# Altium schematic sheet Power_Invertor.SchDoc
size 1200 x 800 mm; SheetNumber: 1; SheetTotal: 1
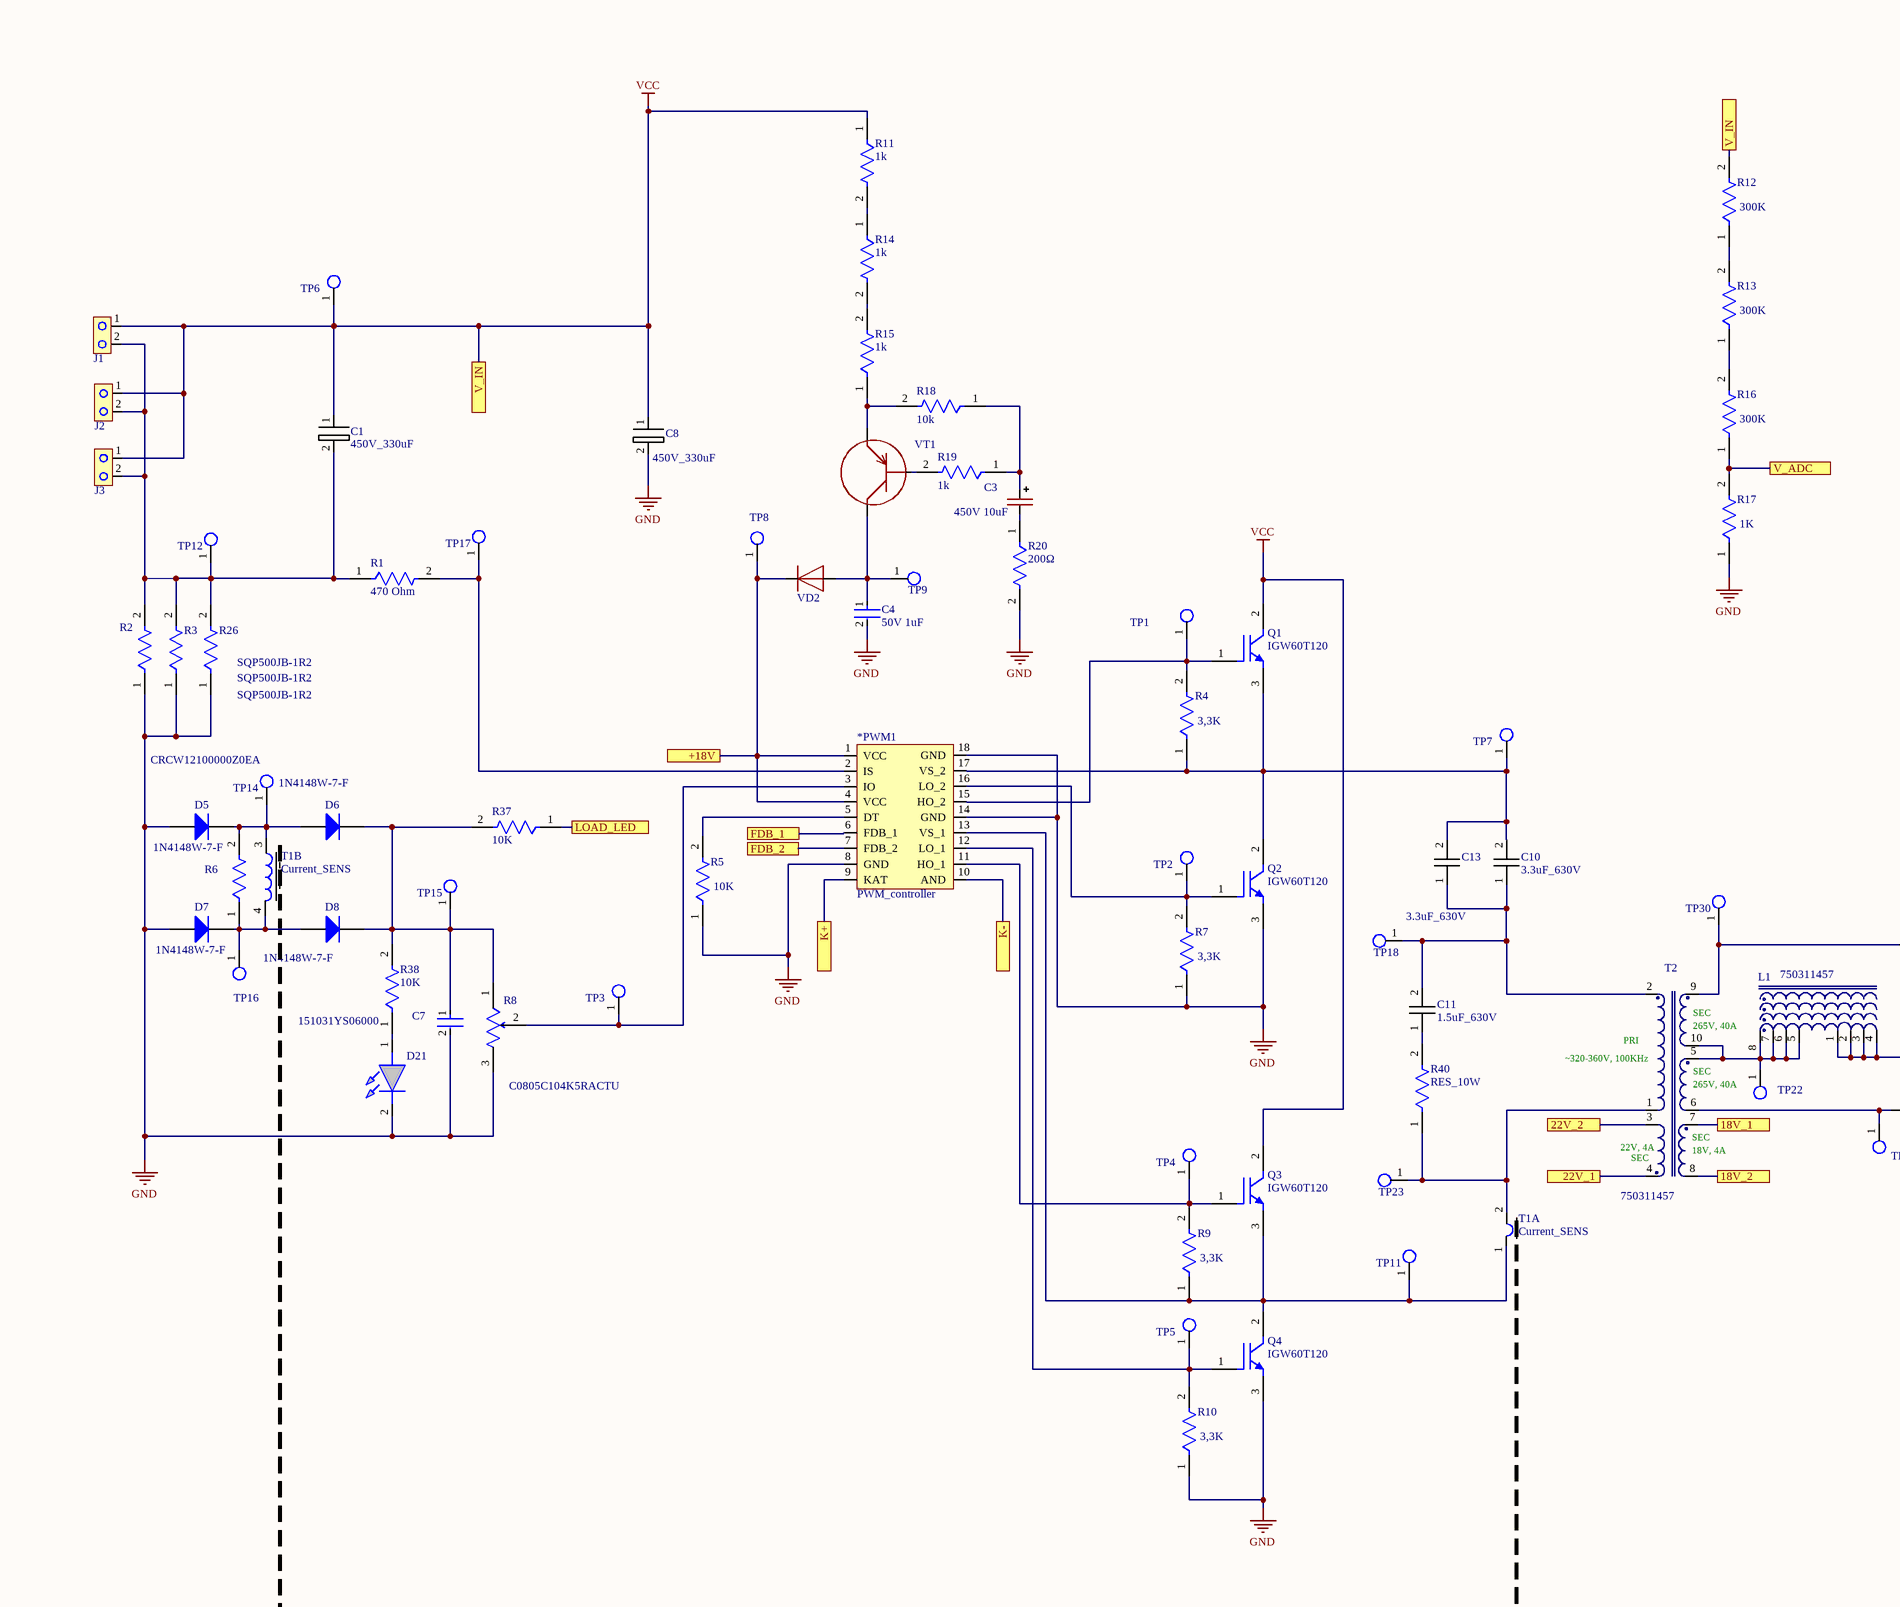
[diagram p0: Power_Invertor.SchDoc, top left]
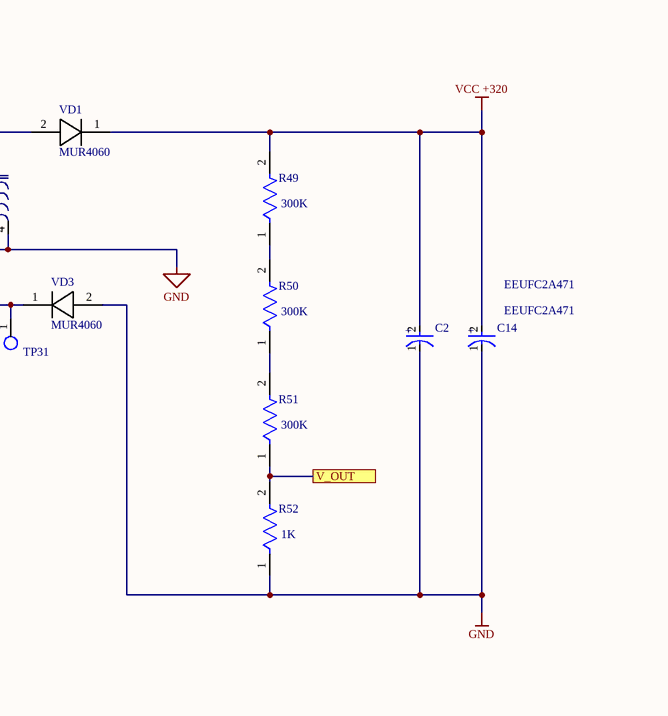
[diagram p1: Power_Invertor.SchDoc, top middle]
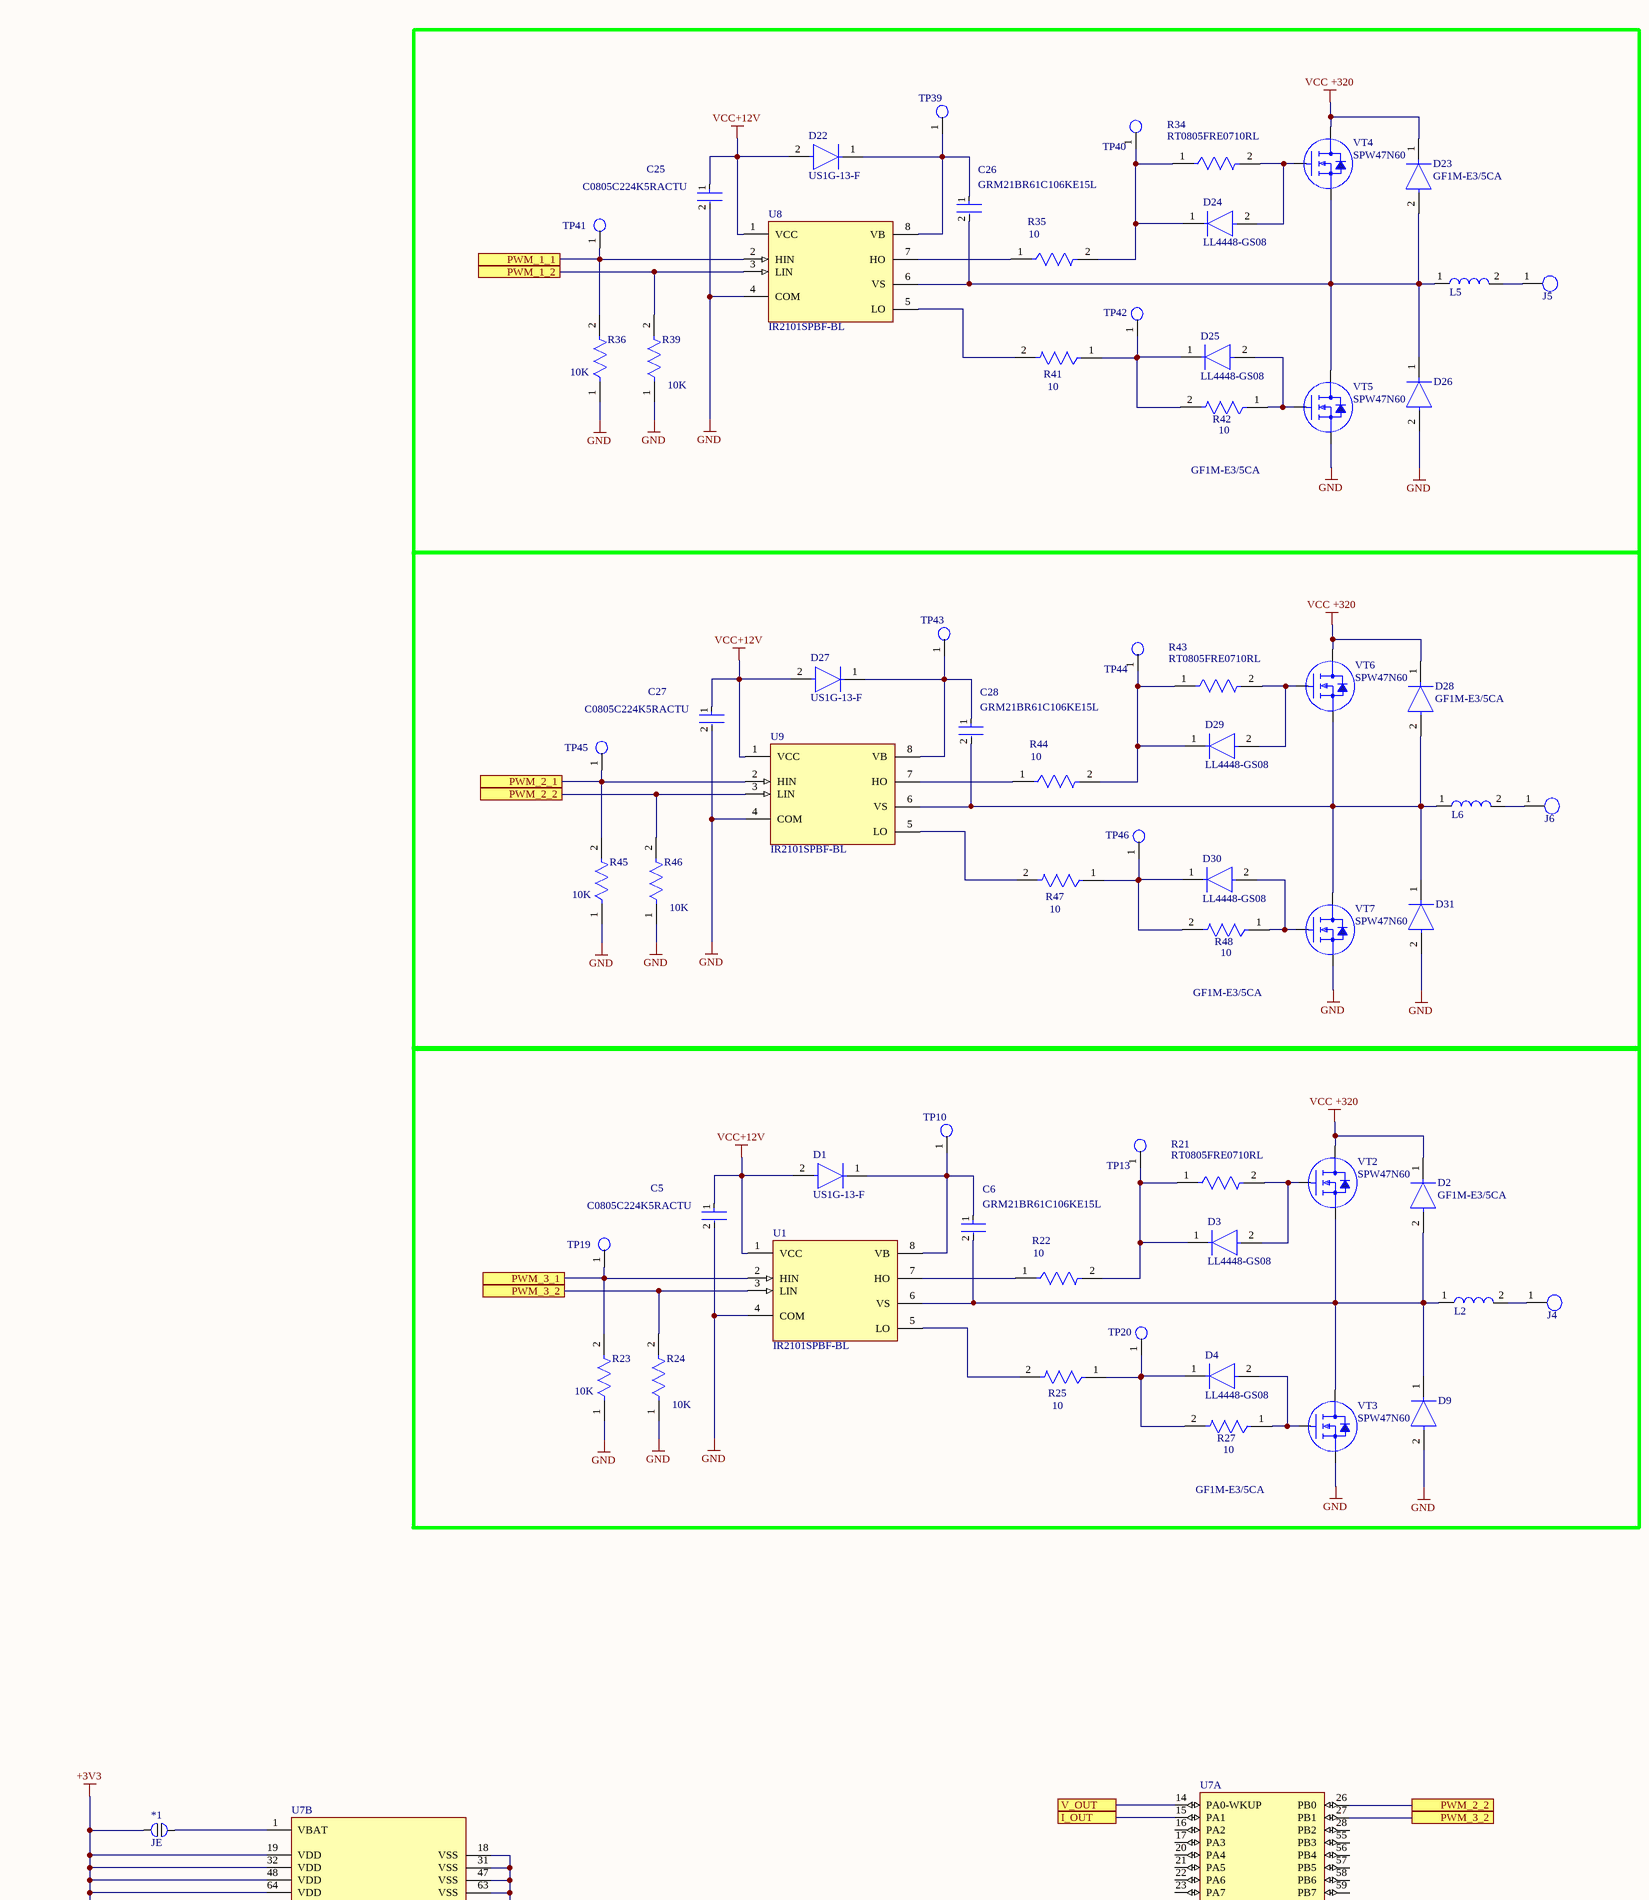
[diagram p2: Power_Invertor.SchDoc, top right]
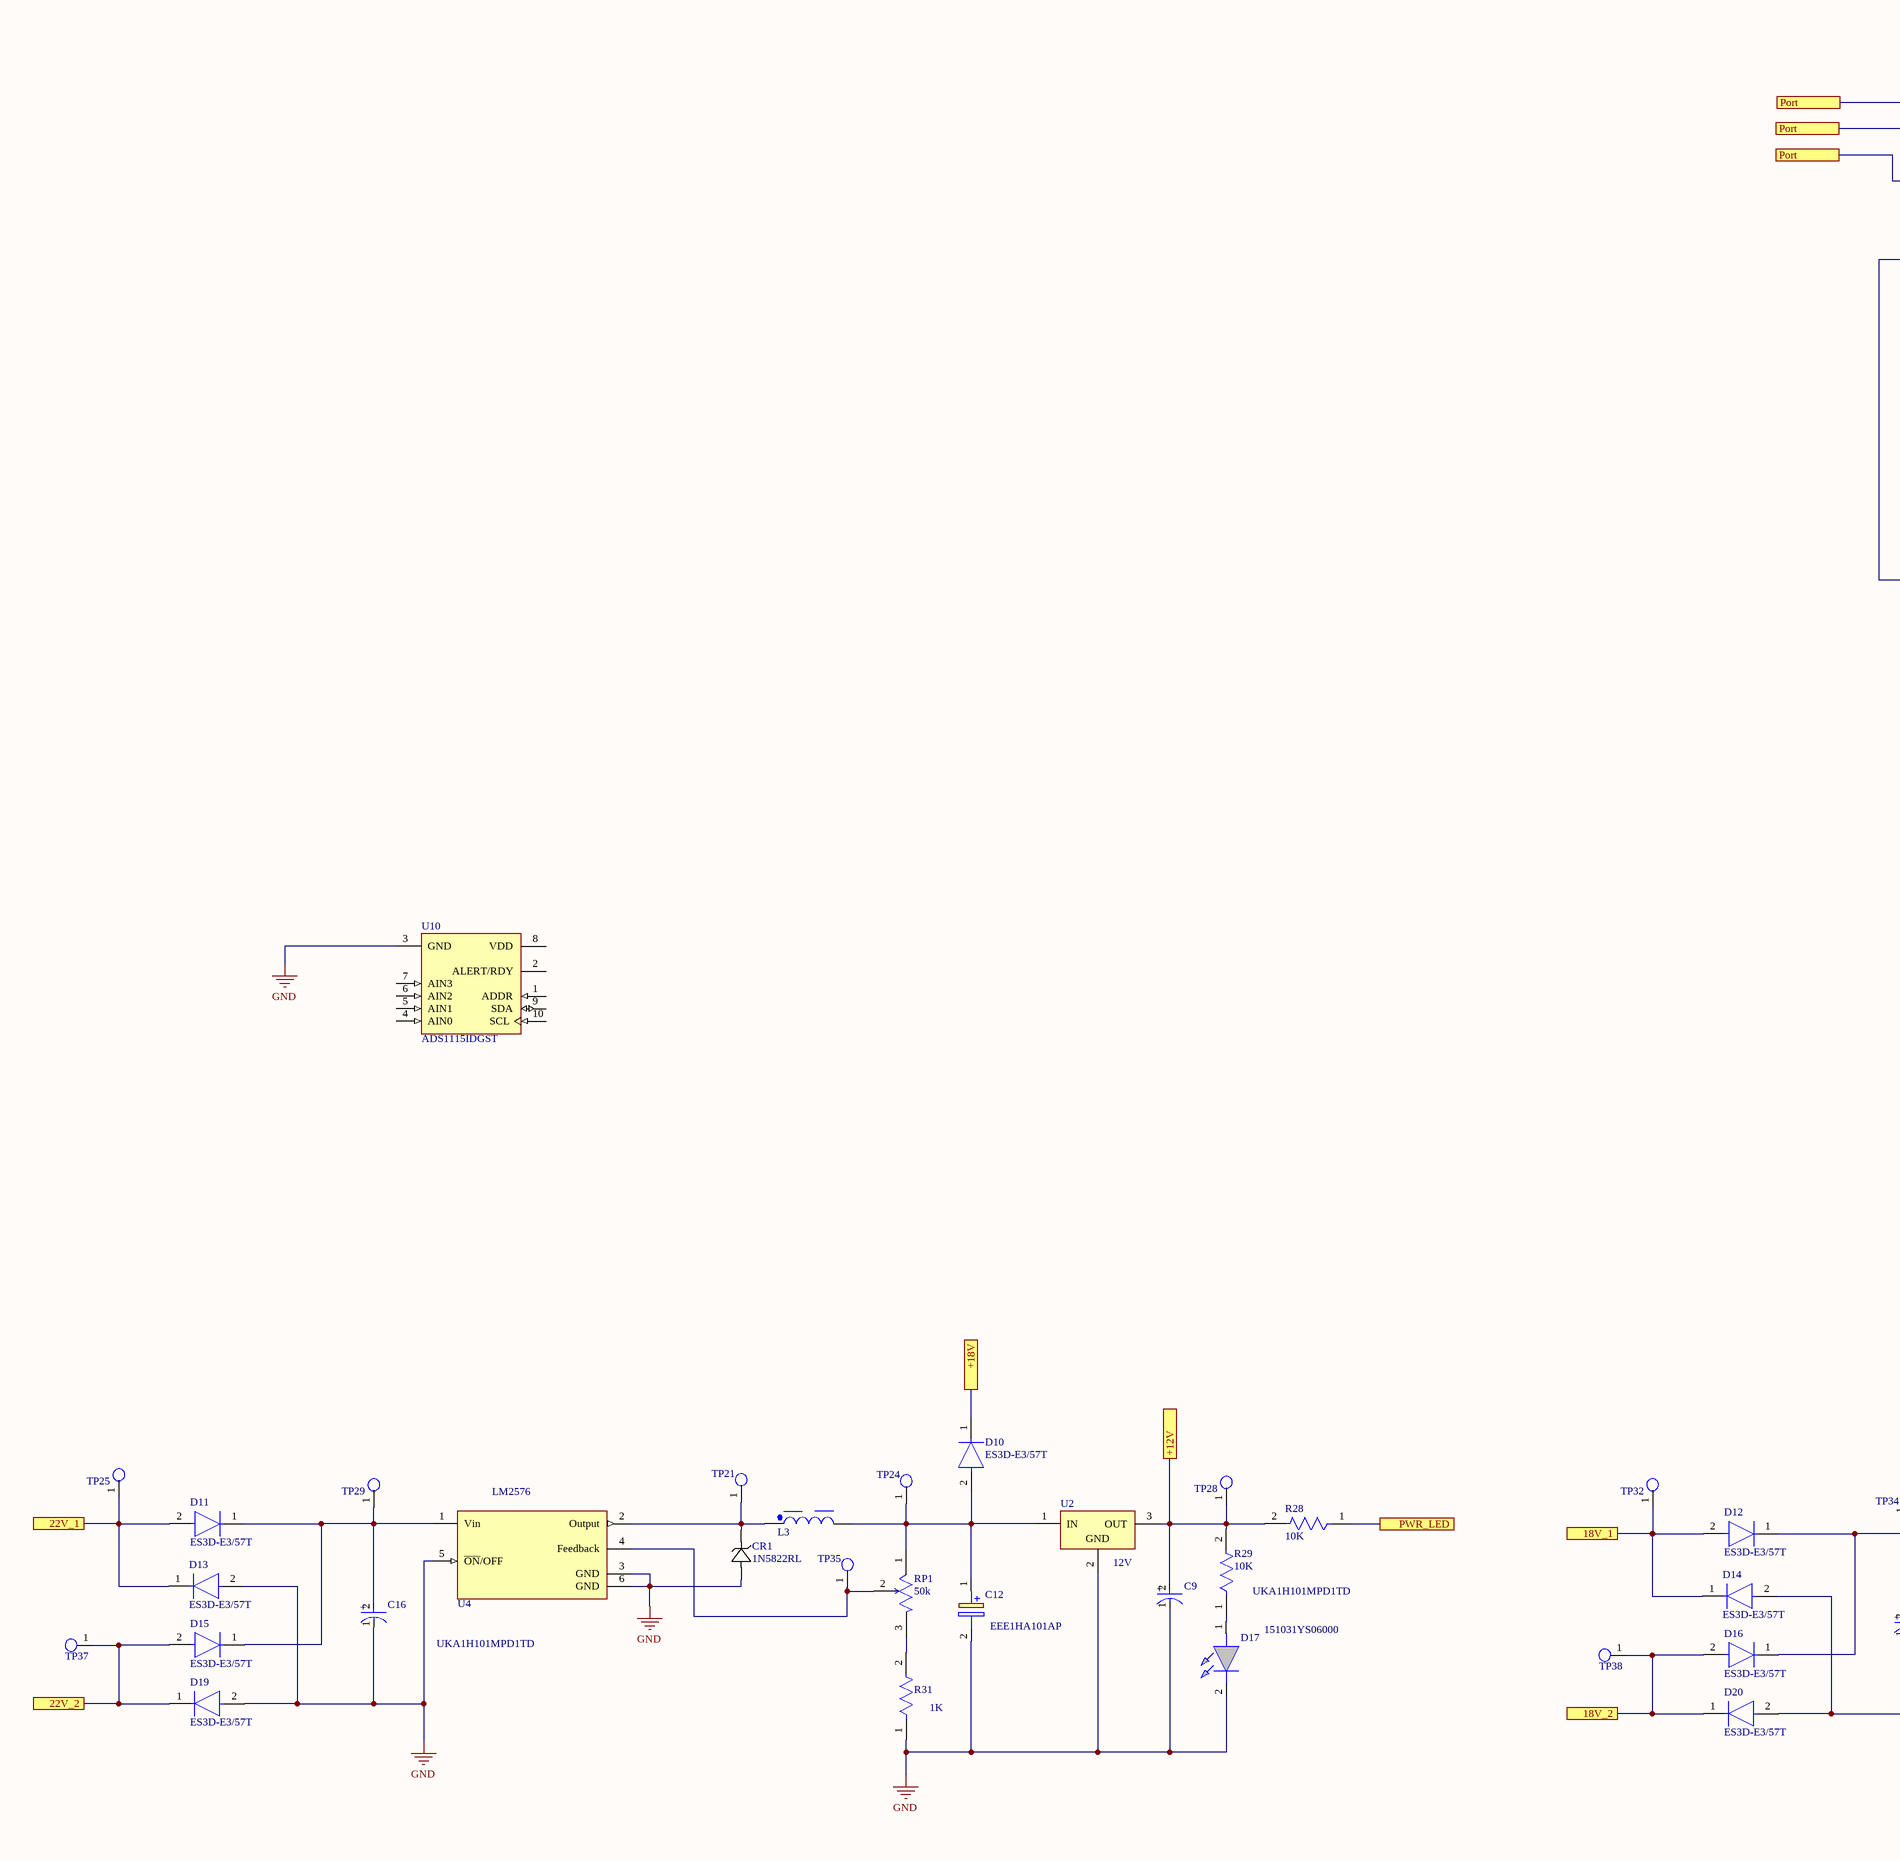
[diagram p3: Power_Invertor.SchDoc, bottom left]
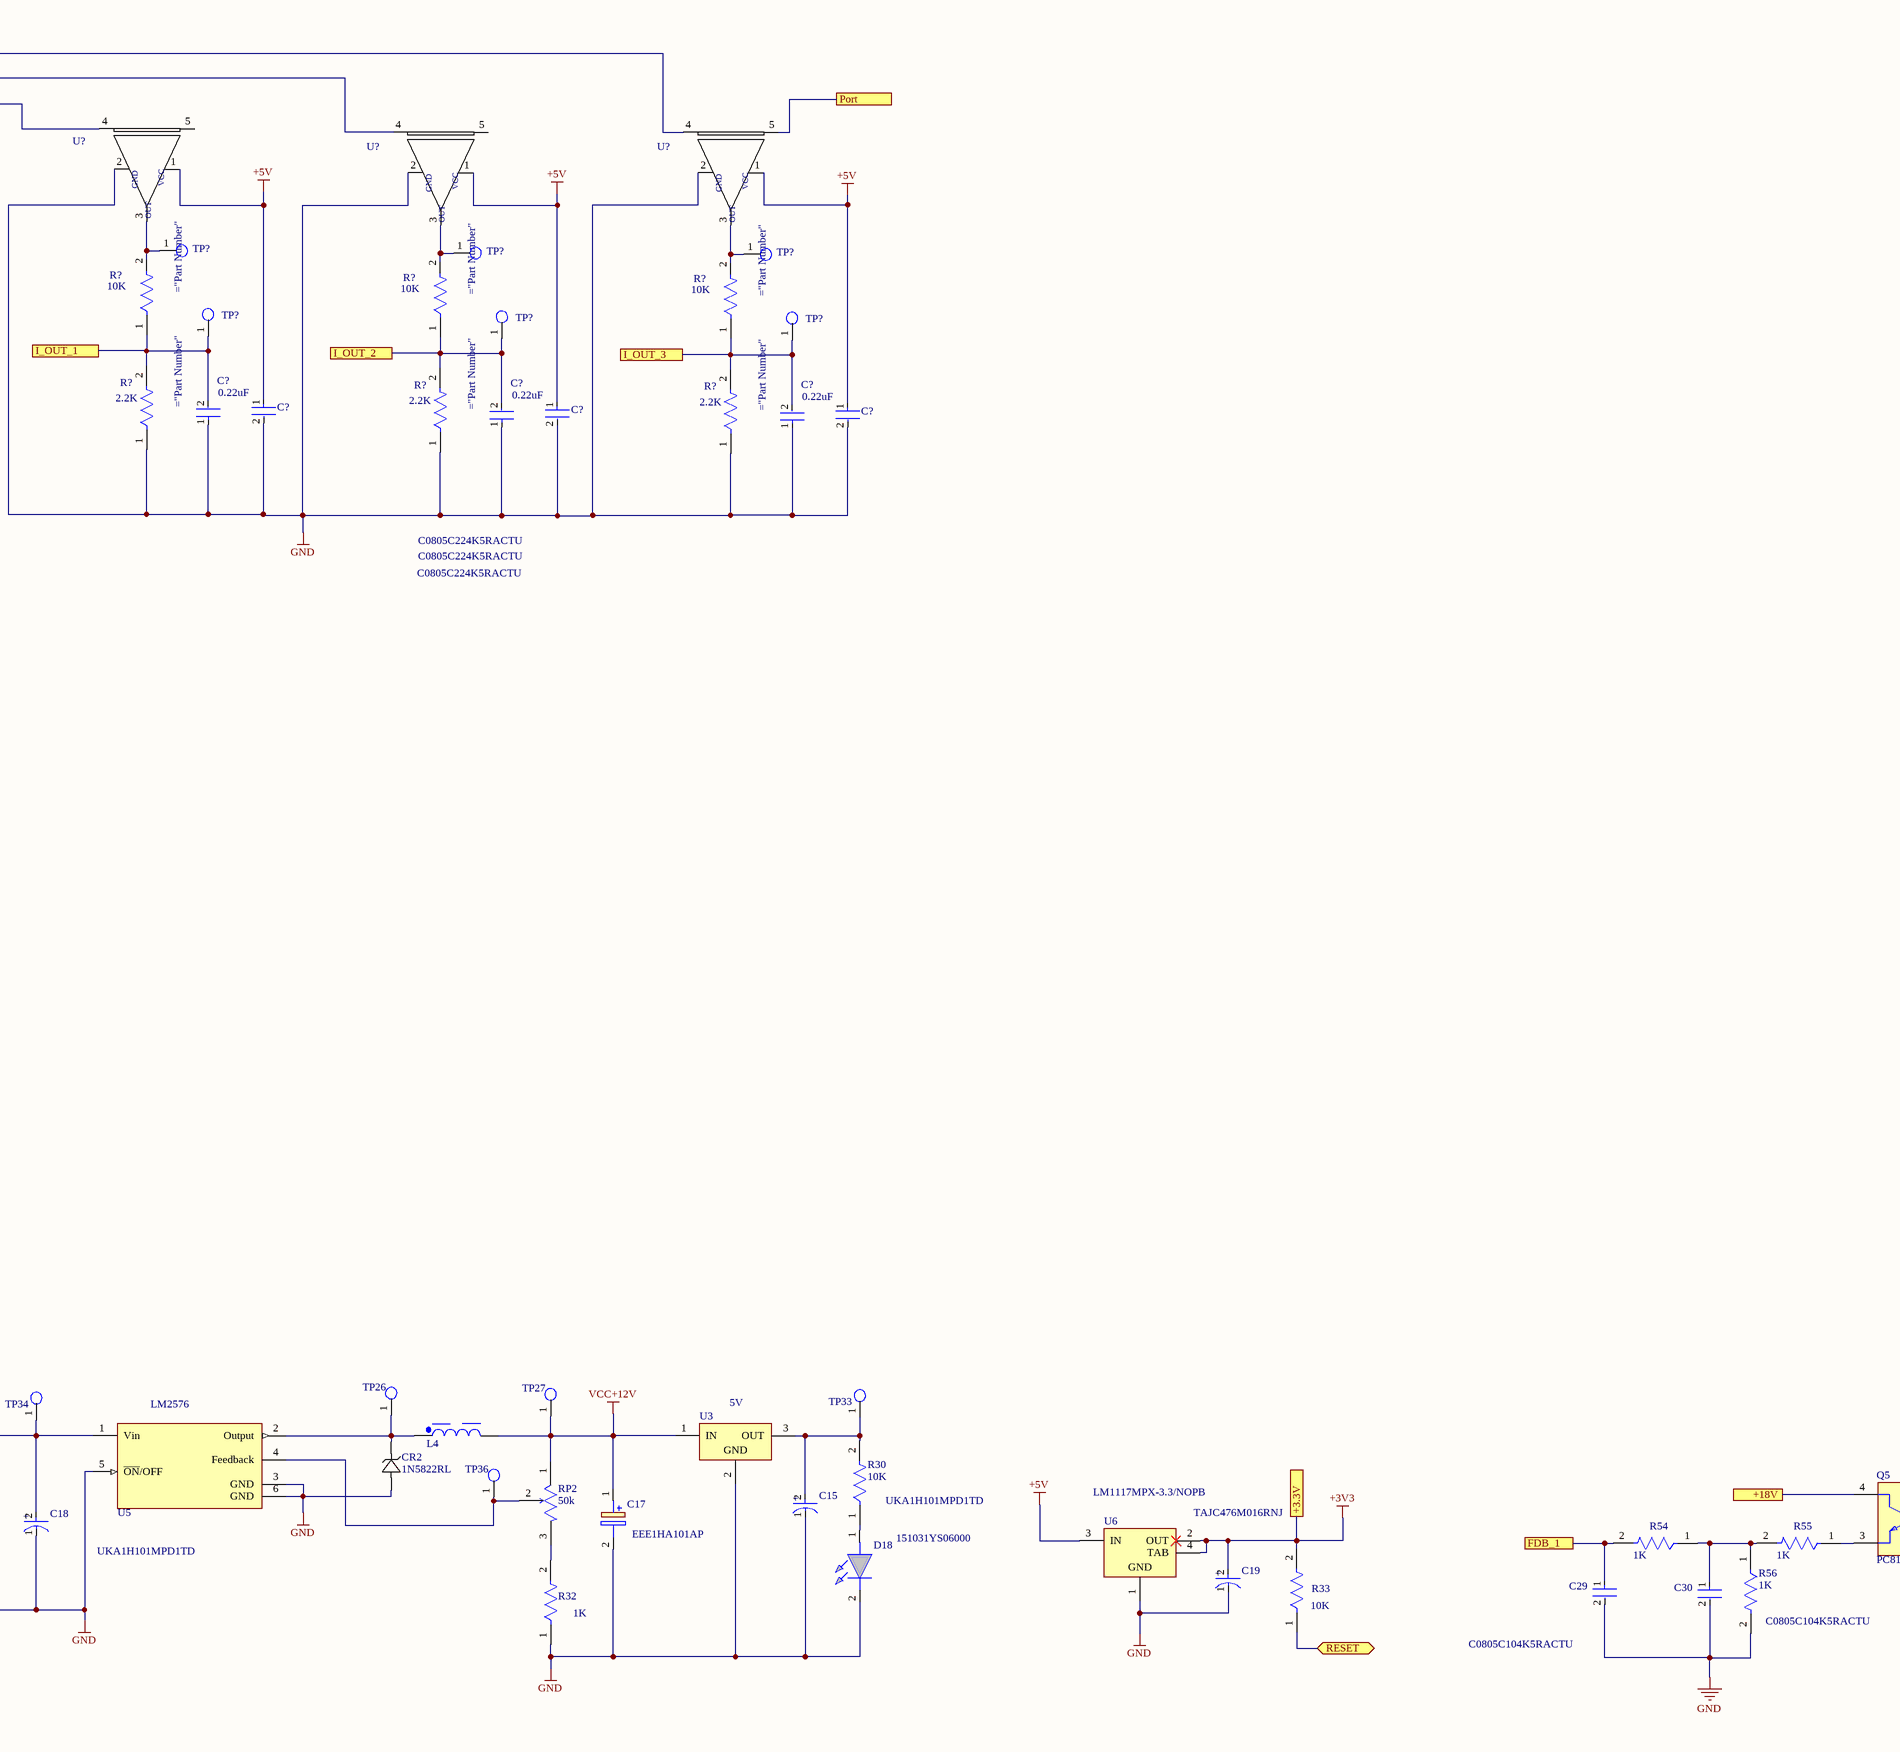
[diagram p4: Power_Invertor.SchDoc, bottom middle]
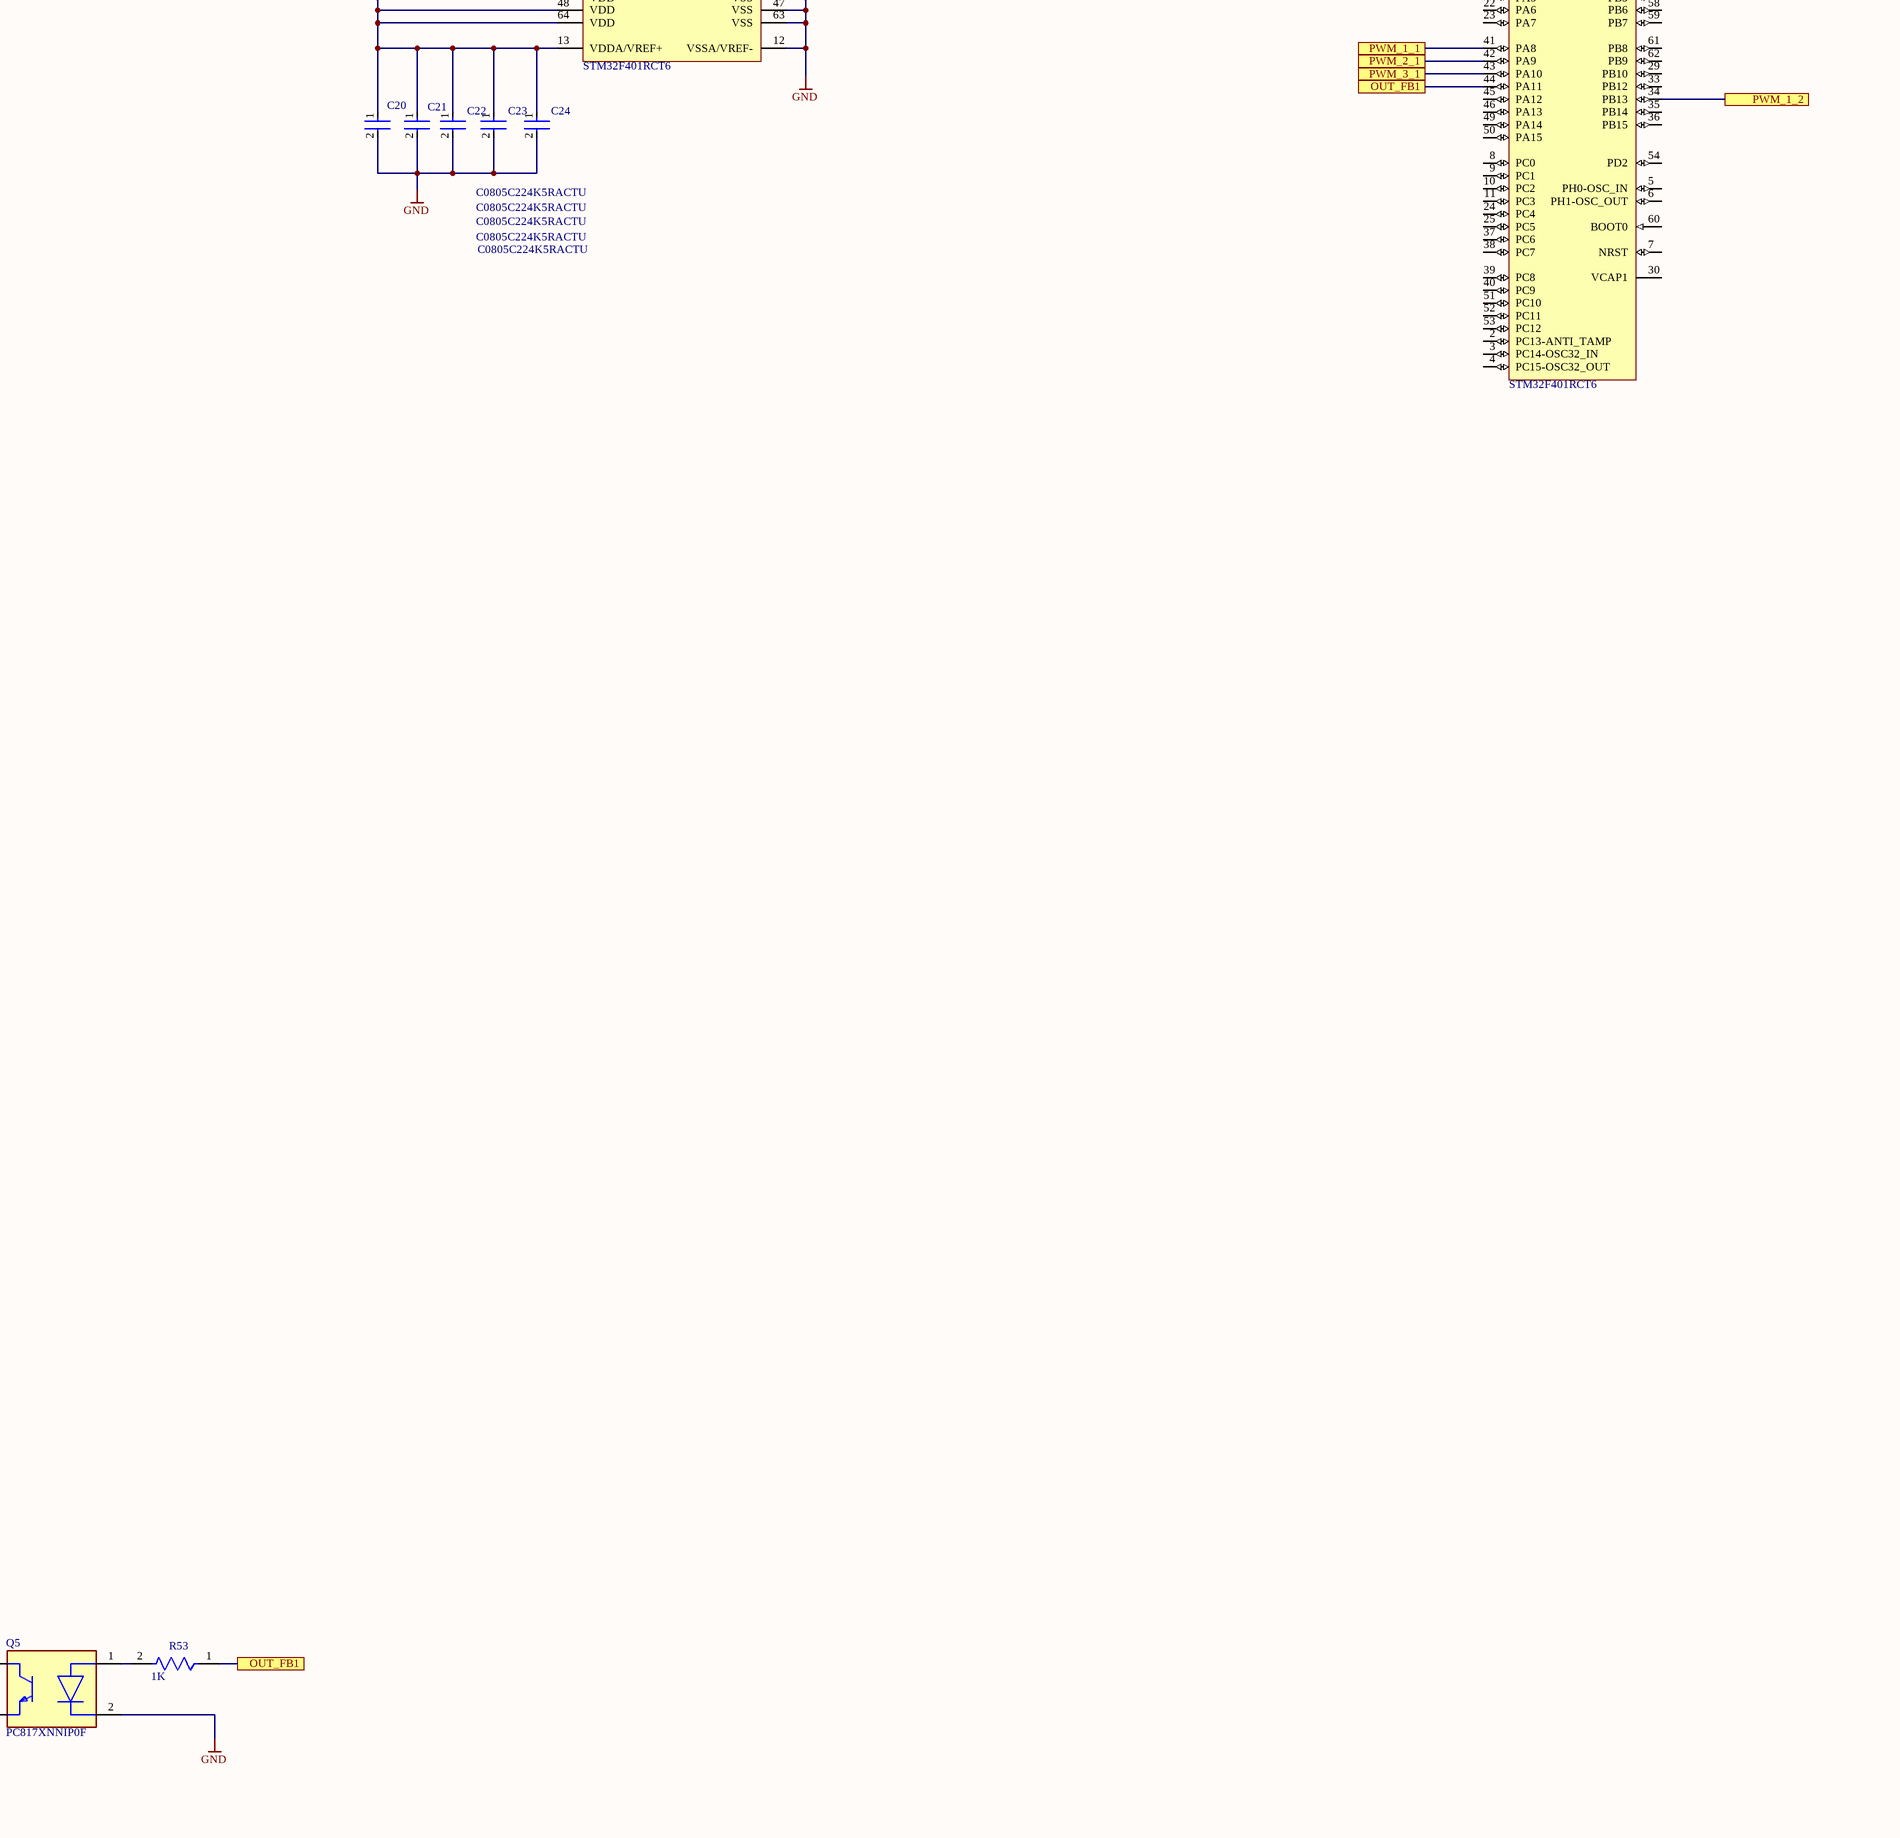
[diagram p5: Power_Invertor.SchDoc, bottom right]

## Parts
(Parts that share a designator on the sheet are numbered #1, #2 ... from top to bottom, then left to right.)
*1  JE  [JE]
*PWM1  PWM_controller  [PWM_controller]
C1  450V_330uF  [CAP_450V_330uF]
C2  EEUFC2A471  [FP-RAD-TH-D_16_0_5-L_40_2-MFG]
C3  450V 10uF  [CAPPOL-12x25]
C4  50V 1uF  [FP-C0805C-DN-IPC_A]
C5  C0805C224K5RACTU  [FP-C0805C-DN-MFG]
C6  GRM21BR61C106KE15L  [FP-GRM21B-0_1-IPC_C]
C7  C0805C104K5RACTU  [FP-C0805C-DN-MFG]
C8  450V_330uF  [CAP_450V_470uF]
C9  UKA1H101MPD1TD  [FP-UKA1H101MPD1TD-MFG]
C10  3.3uF_630V  [CAP_4.7uF_630V]
C11  1.5uF_630V  [CAP_1.5uf_400V]
C12  EEE1HA101AP  [EEEFK1V331P]
C13  3.3uF_630V  [CAP_4.7uF_630V]
C14  EEUFC2A471  [FP-RAD-TH-D_16_0_5-L_40_2-MFG]
C15  UKA1H101MPD1TD  [FP-UKA1H101MPD1TD-MFG]
C16  UKA1H101MPD1TD  [FP-UKA1H101MPD1TD-MFG]
C17  EEE1HA101AP  [EEEFK1V331P]
C18  UKA1H101MPD1TD  [FP-UKA1H101MPD1TD-MFG]
C19  TAJC476M016RNJ  [FP-TAJC-MFG]
C20  C0805C224K5RACTU  [FP-C0805C-DN-IPC_A]
C21  C0805C224K5RACTU  [FP-C0805C-DN-IPC_A]
C22  C0805C224K5RACTU  [FP-C0805C-DN-IPC_A]
C23  C0805C224K5RACTU  [FP-C0805C-DN-IPC_A]
C24  C0805C224K5RACTU  [FP-C0805C-DN-IPC_A]
C25  C0805C224K5RACTU  [FP-C0805C-DN-MFG]
C26  GRM21BR61C106KE15L  [FP-GRM21B-0_1-IPC_C]
C27  C0805C224K5RACTU  [FP-C0805C-DN-MFG]
C28  GRM21BR61C106KE15L  [FP-GRM21B-0_1-IPC_C]
C29  C0805C104K5RACTU  [FP-C0805C-DN-MFG]
C30  C0805C104K5RACTU  [FP-C0805C-DN-MFG]
C?#1  C0805C224K5RACTU  [FP-C0805C-DN-MFG]
C?#2  C0805C224K5RACTU  [FP-C0805C-DN-MFG]
C?#3  C0805C224K5RACTU  [FP-C0805C-DN-MFG]
C?#4  0.22uF  [FP-C0805C-DN-MFG]
C?#5  0.22uF  [FP-C0805C-DN-MFG]
C?#6  0.22uF  [FP-C0805C-DN-MFG]
CR1  1N5822RL  [DO-201AD_STM]
CR2  1N5822RL  [DO-201AD_STM]
D1  US1G-13-F  [FP-SMA-MFG]
D2  GF1M-E3/5CA  [FP-GF1M-E3-5CA-MFG]
D3  LL4448-GS08  [FP-6_560-5005_01-4-MFG]
D4  LL4448-GS08  [FP-6_560-5005_01-4-MFG]
D5  1N4148W-7-F  [DIOD-SOD123-2_V]
D6  1N4148W-7-F  [DIOD-SOD123-2_V]
D7  1N4148W-7-F  [DIOD-SOD123-2_V]
D8  1N4148W-7-F  [DIOD-SOD123-2_V]
D9  GF1M-E3/5CA  [FP-GF1M-E3-5CA-MFG]
D10  ES3D-E3/57T  [FP-95402-MFG]
D11  ES3D-E3/57T  [FP-95402-MFG]
D12  ES3D-E3/57T  [FP-95402-MFG]
D13  ES3D-E3/57T  [FP-95402-MFG]
D14  ES3D-E3/57T  [FP-95402-MFG]
D15  ES3D-E3/57T  [FP-95402-MFG]
D16  ES3D-E3/57T  [FP-95402-MFG]
D17  151031YS06000  [LED_BLUE]
D18  151031YS06000  [LED_BLUE]
D19  ES3D-E3/57T  [FP-95402-MFG]
D20  ES3D-E3/57T  [FP-95402-MFG]
D21  151031YS06000  [LED_GREEN]
D22  US1G-13-F  [FP-SMA-MFG]
D23  GF1M-E3/5CA  [FP-GF1M-E3-5CA-MFG]
D24  LL4448-GS08  [FP-6_560-5005_01-4-MFG]
D25  LL4448-GS08  [FP-6_560-5005_01-4-MFG]
D26  GF1M-E3/5CA  [FP-GF1M-E3-5CA-MFG]
D27  US1G-13-F  [FP-SMA-MFG]
D28  GF1M-E3/5CA  [FP-GF1M-E3-5CA-MFG]
D29  LL4448-GS08  [FP-6_560-5005_01-4-MFG]
D30  LL4448-GS08  [FP-6_560-5005_01-4-MFG]
D31  GF1M-E3/5CA  [FP-GF1M-E3-5CA-MFG]
J1  TL-800  [Conn_Tianli_T-800]  (value not drawn)
J2  TL-800  [Conn_Tianli_T-800]  (value not drawn)
J3  TL-800  [Conn_Tianli_T-800]  (value not drawn)
J4  KLS8-M3  [KLS8-M3]  (value not drawn)
J5  KLS8-M3  [KLS8-M3]  (value not drawn)
J6  KLS8-M3  [KLS8-M3]  (value not drawn)
L1  750311457  [Transformer]
L2  Coil  [Coil_drosel]  (value not drawn)
L3  22µH, 2.04A  [WE-PD2_1054]  (value not drawn)
L4  22µH, 2.04A  [WE-PD2_1054]  (value not drawn)
L5  Coil  [Coil_drosel]  (value not drawn)
L6  Coil  [Coil_drosel]  (value not drawn)
Q1  IGW60T120  [TO-264-3]
Q2  IGW60T120  [TO-264-3]
Q3  IGW60T120  [TO-264-3]
Q4  IGW60T120  [TO-264-3]
Q5  PC817XNNIP0F  [FP-PC817XNNIP0F-MFG]
R1  470 Ohm  [FP-CRCW0805-e3-MFG]
R2  SQP500JB-1R2  [FP-SQP500-MFG]
R3  SQP500JB-1R2  [FP-SQP500-MFG]
R4  3,3K  [FP-CRCW1210-e3-IPC_A]
R5  10K  [FP-CRCW1210-e3-IPC_A]
R6  CRCW12100000Z0EA  [FP-CRCW1210-e3-IPC_A]
R7  3,3K  [FP-CRCW1210-e3-IPC_A]
R8  3296W-1-202LF  [Bourns_3296W_MFG]  (value not drawn)
R9  3,3K  [FP-CRCW1210-e3-IPC_A]
R10  3,3K  [FP-CRCW1210-e3-IPC_A]
R11  1k  [Vishay_CRCW0805-e3_IPC_A]
R12  300K  [FP-CRCW1210-e3-IPC_A]
R13  300K  [FP-CRCW1210-e3-IPC_A]
R14  1k  [Vishay_CRCW0805-e3_IPC_A]
R15  1k  [Vishay_CRCW0805-e3_IPC_A]
R16  300K  [FP-CRCW1210-e3-IPC_A]
R17  1K  [FP-CRCW1210-e3-IPC_A]
R18  10k  [Vishay_CRCW0805-e3_IPC_A]
R19  1k  [Vishay_CRCW0805-e3_IPC_A]
R20  200Ω  [Vishay_CRCW0805-e3_IPC_A]
R21  RT0805FRE0710RL  [FP-RT0805-IPC_C]
R22  10  [FP-RT0805-MFG]
R23  10K  [FP-CRCW0805-e3-IPC_A]
R24  10K  [FP-CRCW0805-e3-IPC_A]
R25  10  [Vishay_CRCW0805-e3_IPC_A]
R26  SQP500JB-1R2  [FP-SQP500-MFG]
R27  10  [FP-CRCW0805-e3-IPC_B]
R28  10K  [FP-CRCW0805-e3-MFG]
R29  10K  [FP-CRCW0805-e3-MFG]
R30  10K  [FP-CRCW0805-e3-MFG]
R31  1K  [Vishay_CRCW0805-e3_IPC_C]
R32  1K  [Vishay_CRCW0805-e3_IPC_C]
R33  10K  [Vishay_CRCW0805-e3_IPC_A]
R34  RT0805FRE0710RL  [FP-RT0805-IPC_C]
R35  10  [FP-RT0805-MFG]
R36  10K  [FP-CRCW0805-e3-IPC_A]
R37  10K  [FP-CRCW0805-e3-MFG]
R38  10K  [FP-CRCW0805-e3-MFG]
R39  10K  [FP-CRCW0805-e3-IPC_A]
R40  RES_10W  [10W 3 Ohm]
R41  10  [Vishay_CRCW0805-e3_IPC_A]
R42  10  [FP-CRCW0805-e3-IPC_B]
R43  RT0805FRE0710RL  [FP-RT0805-IPC_C]
R44  10  [FP-RT0805-MFG]
R45  10K  [FP-CRCW0805-e3-IPC_A]
R46  10K  [FP-CRCW0805-e3-IPC_A]
R47  10  [Vishay_CRCW0805-e3_IPC_A]
R48  10  [FP-CRCW0805-e3-IPC_B]
R49  300K  [FP-CRCW1210-e3-IPC_A]
R50  300K  [FP-CRCW1210-e3-IPC_A]
R51  300K  [FP-CRCW1210-e3-IPC_A]
R52  1K  [FP-CRCW1210-e3-IPC_A]
R53  1K  [Vishay_CRCW0805-e3_IPC_C]
R54  1K  [Vishay_CRCW0805-e3_IPC_C]
R55  1K  [Vishay_CRCW0805-e3_IPC_C]
R56  1K  [Vishay_CRCW0805-e3_IPC_C]
R?#1  10K  [Vishay_CRCW0805-e3_IPC_A]
R?#2  10K  [Vishay_CRCW0805-e3_IPC_A]
R?#3  10K  [Vishay_CRCW0805-e3_IPC_A]
R?#4  2.2K  [Vishay_CRCW0805-e3_IPC_A]
R?#5  2.2K  [Vishay_CRCW0805-e3_IPC_A]
R?#6  2.2K  [Vishay_CRCW0805-e3_IPC_A]
RP1  50k  [Bourns_3296W_MFG]
RP2  50k  [Bourns_3296W_MFG]
T1  Current_SENS  [Current_SENS]  (parts A,B of 2)
T2  750311457  [Transformer]
TP1  Test_Point_PCB  [Test_Point]  (value not drawn)
TP2  Test_Point_PCB  [Test_Point]  (value not drawn)
TP3  Test_Point_PCB  [Test_Point]  (value not drawn)
TP4  Test_Point_PCB  [Test_Point]  (value not drawn)
TP5  Test_Point_PCB  [Test_Point]  (value not drawn)
TP6  Test_Point_PCB  [Test_Point]  (value not drawn)
TP7  Test_Point_PCB  [Test_Point]  (value not drawn)
TP8  Test_Point_PCB  [Test_Point]  (value not drawn)
TP9  Test_Point_PCB  [Test_Point]  (value not drawn)
TP10  Test_Point_PCB  [Test_Point]  (value not drawn)
TP11  Test_Point_PCB  [Test_Point]  (value not drawn)
TP12  Test_Point_PCB  [Test_Point]  (value not drawn)
TP13  Test_Point_PCB  [Test_Point]  (value not drawn)
TP14  Test_Point_PCB  [Test_Point]  (value not drawn)
TP15  Test_Point_PCB  [Test_Point]  (value not drawn)
TP16  Test_Point_PCB  [Test_Point]  (value not drawn)
TP17  Test_Point_PCB  [Test_Point]  (value not drawn)
TP18  Test_Point_PCB  [Test_Point]  (value not drawn)
TP19  Test_Point_PCB  [Test_Point]  (value not drawn)
TP20  Test_Point_PCB  [Test_Point]  (value not drawn)
TP21  Test_Point_PCB  [Test_Point]  (value not drawn)
TP22  Test_Point_PCB  [Test_Point]  (value not drawn)
TP23  Test_Point_PCB  [Test_Point]  (value not drawn)
TP24  Test_Point_PCB  [Test_Point]  (value not drawn)
TP25  Test_Point_PCB  [Test_Point]  (value not drawn)
TP26  Test_Point_PCB  [Test_Point]  (value not drawn)
TP27  Test_Point_PCB  [Test_Point]  (value not drawn)
TP28  Test_Point_PCB  [Test_Point]  (value not drawn)
TP29  Test_Point_PCB  [Test_Point]  (value not drawn)
TP30  Test_Point_PCB  [Test_Point]  (value not drawn)
TP31  Test_Point_PCB  [Test_Point]  (value not drawn)
TP32  Test_Point_PCB  [Test_Point]  (value not drawn)
TP33  Test_Point_PCB  [Test_Point]  (value not drawn)
TP34  Test_Point_PCB  [Test_Point]  (value not drawn)
TP35  Test_Point_PCB  [Test_Point]  (value not drawn)
TP36  Test_Point_PCB  [Test_Point]  (value not drawn)
TP37  Test_Point_PCB  [Test_Point]  (value not drawn)
TP38  Test_Point_PCB  [Test_Point]  (value not drawn)
TP39  Test_Point_PCB  [Test_Point]  (value not drawn)
TP40  Test_Point_PCB  [Test_Point]  (value not drawn)
TP41  Test_Point_PCB  [Test_Point]  (value not drawn)
TP42  Test_Point_PCB  [Test_Point]  (value not drawn)
TP43  Test_Point_PCB  [Test_Point]  (value not drawn)
TP44  Test_Point_PCB  [Test_Point]  (value not drawn)
TP45  Test_Point_PCB  [Test_Point]  (value not drawn)
TP46  Test_Point_PCB  [Test_Point]  (value not drawn)
TP?#1  Test_Point_PCB  [Test_Point]  (value not drawn)
TP?#2  Test_Point_PCB  [Test_Point]  (value not drawn)
TP?#3  Test_Point_PCB  [Test_Point]  (value not drawn)
TP?#4  Test_Point_PCB  [Test_Point]  (value not drawn)
TP?#5  Test_Point_PCB  [Test_Point]  (value not drawn)
TP?#6  Test_Point_PCB  [Test_Point]  (value not drawn)
U1  IR2101SPBF-BL  [FP-PG-DSO-8-IPC_B]
U2  12V  [TO-220_Bended_Rad]
U3  5V  [TO-220_Bended_Rad]
U4  LM2576  [ON_Semiconductor_936A-02_MFG]
U5  LM2576  [ON_Semiconductor_936A-02_MFG]
U6  LM1117MPX-3.3/NOPB  [DCY0004A_L]
U7  STM32F401RCT6  [STM-LQFP64_M]  (parts A,B of 2)
U8  IR2101SPBF-BL  [FP-PG-DSO-8-IPC_B]
U9  IR2101SPBF-BL  [FP-PG-DSO-8-IPC_B]
U10  ADS1115IDGST  [TI-DGS10_N]
U?#1  ACS758  [ACS758-100]  (value not drawn)
U?#2  ACS758  [ACS758-100]  (value not drawn)
U?#3  ACS758  [ACS758-100]  (value not drawn)
VD1  MUR4060  [TO-247-2]
VD2  DIODE  [DO-214AC, SMA]  (value not drawn)
VD3  MUR4060  [TO-247-2]
VT1  BIPOLAR-PNP-BCE  [SOT-223-3]  (value not drawn)
VT2  SPW47N60  [TO-220(bend2)]
VT3  SPW47N60  [TO-220(bend2)]
VT4  SPW47N60  [TO-220(bend2)]
VT5  SPW47N60  [TO-220(bend2)]
VT6  SPW47N60  [TO-220(bend2)]
VT7  SPW47N60  [TO-220(bend2)]

## Ports
18V_1, 18V_2, 22V_1, 22V_2, +3.3V, +12V, +18V, FDB_1, FDB_2, I_OUT, I_OUT_1, I_OUT_2, I_OUT_3, K+, K-, LOAD_LED, OUT_FB1, Port, PWM_1_1, PWM_1_2, PWM_2_1, PWM_2_2, PWM_3_1, PWM_3_2, PWR_LED, RESET (bidir), V_ADC, V_IN, V_OUT

## Nets
+3V3: *1.1 C19.2(A) C20.1 C21.1 C22.1 C23.1 C24.1 R33.2 U6.2(OUT) U6.4(TAB) U7.13(VDDA/VREF+) U7.19(VDD) U7.32(VDD) U7.48(VDD) U7.64(VDD) ; port +3.3V
+5V: C?#1.1 C?#2.1 C?#3.1 U6.3(IN) U?#1.1(+VCC) U?#2.1(+VCC) U?#3.1(+VCC)
GND: *PWM1.8(GND) *PWM1.14(GND) *PWM1.18(GND) C2.1(C) C4.2 C5.2 C7.2 C8.2 C9.1(C) C12.2(-) C14.1(C) C15.1(C) C16.1(C) C17.2(-) C18.1(C) C19.1(C) C20.2 C21.2 C22.2 C23.2 C24.2 C25.2 C27.2 C29.2 C30.2 C?#1.2 C?#2.2 C?#3.2 C?#4.1 C?#5.1 C?#6.1 CR1.2 CR2.2 D5.1(A) D7.1(A) D9.2(A) D13.2(A) D14.2(A) D17.2(K) D18.2(K) D19.2(A) D20.2(A) D21.2(K) D26.2(A) D31.2(A) L1.1 L1.2 L1.3 L1.4 Q2.3(E) Q4.3(E) Q5.2(C) R2.1 R3.1 R5.1 R7.1 R8.3(CW) R10.1 R17.1 R20.2 R23.1 R24.1 R26.1 R31.1 R32.1 R36.1 R39.1 R45.1 R46.1 R52.1 R56.2 R?#4.1 R?#5.1 R?#6.1 U1.4(COM) U2.2(GND) U3.2(GND) U4.3(GND) U4.5(~{ON}/OFF) U4.6(GND) U5.3(GND) U5.5(~{ON}/OFF) U5.6(GND) U6.1(GND) U7.12(VSSA/VREF-) U7.18(VSS) U7.31(VSS) U7.47(VSS) U7.63(VSS) U8.4(COM) U9.4(COM) U10.3(GND) U?#1.2(GND) U?#2.2(GND) U?#3.2(GND) VD3.2 VT3.S VT5.S VT7.S
VCC: C1.1 C8.1 J1.1 J2.1 J3.1 Q1.2(C) Q3.2(C) R11.1 R12.2 TP6.1(G9) ; port V_IN
VCC +320: C2.2(A) C14.2(A) D2.1(C) D23.1(C) D28.1(C) R49.2 VD1.1 VT2.D VT4.D VT6.D
VCC+12V: C5.1 C17.1(+) C25.1 C27.1 D1.2(A) D22.2(A) D27.2(A) L4.2 RP2.1(CCW) TP27.1(G9) U1.1(VCC) U3.1(IN) U8.1(VCC) U9.1(VCC)
18V_1: D12.2(A) D14.1(C) T2.7 TP32.1(G9) ; port 18V_1
18V_2: D16.2(A) D20.1(C) T2.8 TP38.1(G9) ; port 18V_2
22V_1: D11.2(A) D13.1(C) T2.4 TP25.1(G9) ; port 22V_1
22V_2: D15.2(A) D19.1(C) T2.3 TP37.1(G9) ; port 22V_2
+12V: C9.2(A) R28.2 R29.2 TP28.1(G9) U2.3(OUT) ; port +12V
+18V: *PWM1.1(VCC) *PWM1.4(VCC) D10.1(C) Q5.4(C) TP8.1(G9) VD2.1(C) ; port +18V
FDB_1: *PWM1.6(FDB_1) C29.1 R54.2 ; port FDB_1
FDB_2: *PWM1.7(FDB_2) ; port FDB_2
I_OUT: U7.15(PA1) ; port I_OUT
I_OUT_1: C?#4.2 R?#1.1 R?#4.2 TP?#4.1(G9) ; port I_OUT_1
I_OUT_2: C?#5.2 R?#2.1 R?#5.2 TP?#5.1(G9) ; port I_OUT_2
I_OUT_3: C?#6.2 R?#3.1 R?#6.2 TP?#6.1(G9) ; port I_OUT_3
K+: *PWM1.9(KAT) ; port K+
K-: *PWM1.10(AND) ; port K-
LOAD_LED: R37.1 ; port LOAD_LED
OUT_FB1: R53.1 U7.44(PA11) ; port OUT_FB1
Port: U?#1.4(+IP) U?#2.4(+IP) U?#3.4(+IP) U?#3.5(-IP) ; port Port
PWM_1_1: R36.2 TP41.1(G9) U7.41(PA8) U8.2(HIN) ; port PWM_1_1
PWM_1_2: R39.2 U7.34(PB13) U8.3(LIN) ; port PWM_1_2
PWM_2_1: R45.2 TP45.1(G9) U7.42(PA9) U9.2(HIN) ; port PWM_2_1
PWM_2_2: R46.2 U7.26(PB0) U9.3(LIN) ; port PWM_2_2
PWM_3_1: R23.2 TP19.1(G9) U1.2(HIN) U7.43(PA10) ; port PWM_3_1
PWM_3_2: R24.2 U1.3(LIN) U7.27(PB1) ; port PWM_3_2
PWR_LED: R28.1 ; port PWR_LED
RESET: R33.1 ; port RESET
V_ADC: R16.1 R17.2 ; port V_ADC
V_OUT: R51.1 R52.2 U7.14(PA0-WKUP) ; port V_OUT
Net*1_2: *1.2 U7.1(VBAT)
Net*PWM1_2: *PWM1.2(IS) R1.2 TP17.1(G9)
Net*PWM1_3: *PWM1.3(IO) R8.2(WIPER) TP3.1(G9)
Net*PWM1_5: *PWM1.5(DT) R5.2
Net*PWM1_11: *PWM1.11(HO_1) Q3.1(G) R9.2 TP4.1(G9)
Net*PWM1_12: *PWM1.12(LO_1) Q4.1(G) R10.2 TP5.1(G9)
Net*PWM1_13: *PWM1.13(VS_1) Q3.3(E) Q4.2(C) R9.1 T1.1 TP11.1(G9)
Net*PWM1_15: *PWM1.15(HO_2) Q1.1(G) R4.2 TP1.1(G9)
Net*PWM1_16: *PWM1.16(LO_2) Q2.1(G) R7.2 TP2.1(G9)
Net*PWM1_17: *PWM1.17(VS_2) C10.2 C13.2 Q1.3(E) Q2.2(C) R4.1 TP7.1(G9)
NetC1_2: C1.2 J1.2 J2.2 J3.2 R1.1 R2.2 R3.2 R26.2 TP12.1(G9)
NetC3_1: C3.1(+) R18.1 R19.1
NetC3_2: C3.2(-) R20.1
NetC4_1: C4.1 TP9.1(G9) VD2.2(A) VT1.2(C)
NetC6_1: C6.1 D1.1(C) TP10.1(G9) U1.8(VB)
NetC6_2: C6.2 D2.2(A) D9.1(C) L2.1 U1.6(VS) VT2.S VT3.D
NetC7_1: C7.1 D6.2(K) D8.2(K) R8.1(CCW) R37.2 R38.2 TP15.1(G9)
NetC10_1: C10.1 C11.2 C13.1 T2.2 TP18.1(G9)
NetC11_1: C11.1 R40.2
NetC12_1: C12.1(+) D10.2(A) L3.2 RP1.1(CCW) TP24.1(G9) U2.1(IN)
NetC15_2: C15.2(A) R30.2 TP33.1(G9) U3.3(OUT)
NetC16_2: C16.2(A) D11.1(C) D15.1(C) TP29.1(G9) U4.1(Vin)
NetC18_2: C18.2(A) D12.1(C) D16.1(C) TP34.1(G9) U5.1(Vin)
NetC26_1: C26.1 D22.1(C) TP39.1(G9) U8.8(VB)
NetC26_2: C26.2 D23.2(A) D26.1(C) L5.1 U8.6(VS) VT4.S VT5.D
NetC28_1: C28.1 D27.1(C) TP43.1(G9) U9.8(VB)
NetC28_2: C28.2 D28.2(A) D31.1(C) L6.1 U9.6(VS) VT6.S VT7.D
NetC30_1: C30.1 R54.1 R55.2 R56.1
NetCR1_1: CR1.1 L3.1 TP21.1(G9) U4.2(Output)
NetCR2_1: CR2.1 L4.1 TP26.1(G9) U5.2(Output)
NetD3_1: D3.1(C) R21.1 R22.2 TP13.1(G9)
NetD3_2: D3.2(A) R21.2 VT2.G
NetD4_1: D4.1(C) R25.1 R27.2 TP20.1(G9)
NetD4_2: D4.2(A) R27.1 VT3.G
NetD5_2: D5.2(K) D6.1(A) R6.2 T1.3 TP14.1(G9)
NetD7_2: D7.2(K) D8.1(A) R6.1 T1.4 TP16.1(G9)
NetD17_1: D17.1(A) R29.1
NetD18_1: D18.1(A) R30.1
NetD21_1: D21.1(A) R38.1
NetD24_1: D24.1(C) R34.1 R35.2 TP40.1(G9)
NetD24_2: D24.2(A) R34.2 VT4.G
NetD25_1: D25.1(C) R41.1 R42.2 TP42.1(G9)
NetD25_2: D25.2(A) R42.1 VT5.G
NetD29_1: D29.1(C) R43.1 R44.2 TP44.1(G9)
NetD29_2: D29.2(A) R43.2 VT6.G
NetD30_1: D30.1(C) R47.1 R48.2 TP46.1(G9)
NetD30_2: D30.2(A) R48.1 VT7.G
NetJ4_1: J4.1 L2.2
NetJ5_1: J5.1 L5.2
NetJ6_1: J6.1 L6.2
NetL1_5: L1.5 L1.6 L1.7 L1.8 T2.5 T2.10 TP22.1(G9)
NetQ5_1: Q5.1(A) R53.2
NetQ5_3: Q5.3(E) R55.1
NetR11_2: R11.2 R14.1
NetR12_1: R12.1 R13.2
NetR13_1: R13.1 R16.2
NetR14_2: R14.2 R15.2
NetR15_1: R15.1 R18.2 VT1.3(E)
NetR19_2: R19.2 VT1.1(B)
NetR22_1: R22.1 U1.7(HO)
NetR25_2: R25.2 U1.5(LO)
NetR31_2: R31.2 RP1.3(CW)
NetR32_2: R32.2 RP2.3(CW)
NetR35_1: R35.1 U8.7(HO)
NetR40_1: R40.1 T1.2 T2.1 TP23.1(G9)
NetR41_2: R41.2 U8.5(LO)
NetR44_1: R44.1 U9.7(HO)
NetR47_2: R47.2 U9.5(LO)
NetR49_1: R49.1 R50.2
NetR50_1: R50.1 R51.2
NetR?#1_2: R?#1.2 TP?#1.1(G9) U?#1.3(OUT)
NetR?#2_2: R?#2.2 TP?#2.1(G9) U?#2.3(OUT)
NetR?#3_2: R?#3.2 TP?#3.1(G9) U?#3.3(OUT)
NetRP1_2: RP1.2(WIPER) TP35.1(G9) U4.4(Feedback)
NetRP2_2: RP2.2(WIPER) TP36.1(G9) U5.4(Feedback)
NetT2_6: T2.6 TP31.1(G9) VD3.1
NetT2_9: T2.9 TP30.1(G9) VD1.2

Not connected (* = marked no-connect by the designer): U7 2(PC13-ANTI_TAMP) 3(PC14-OSC32_IN) 4(PC15-OSC32_OUT) 5(PH0-OSC_IN) 6(PH1-OSC_OUT) 7(NRST) 8(PC0) 9(PC1) 10(PC2) 11(PC3) 16(PA2) 17(PA3) 20(PA4) 21(PA5) 22(PA6) 23(PA7) 24(PC4) 25(PC5) 28(PB2) 29(PB10) 30(VCAP1) 33(PB12) 35(PB14) 36(PB15) 37(PC6) 38(PC7) 39(PC8) 40(PC9) 45(PA12) 46(PA13) 49(PA14) 50(PA15) 51(PC10) 52(PC11) 53(PC12) 54(PD2) 55(PB3) 56(PB4) 57(PB5) 58(PB6) 59(PB7) 60(BOOT0) 61(PB8) 62(PB9); U10 1(ADDR) 2(ALERT/RDY) 4(AIN0) 5(AIN1) 6(AIN2) 7(AIN3) 8(VDD) 9(SDA) 10(SCL); U?#1 5(-IP); U?#2 5(-IP)

## Notes on the sheet
- (in symbol ACS758) VCC
- (in symbol CMP-04424-000193-1) +
- (in symbol CMP-05427-000270-1) +
- (in symbol CMP-12462-000027-1) +
- (in symbol Transformer) SEC; 265V, 40A; PRI; ~320-360V, 100KHz; 22V, 4A; 18V, 4A

## Library data of the parts
C1 C8 = CAP_450V_330uF
C2 C14 = CMP-05427-000270-1: Aluminum Electrolytic Capacitors (Radial Lead Type) AEC-Q200 Qualified 470uF ±20% 100V; Ripple Current: 1.92A; Impedance: 47mR; Polarity: Polar; Dielectric Material: Aluminium; Lead Diameter: 0.8mm; Life (Hours): 5000Hour; Leakage Current: 3uA; Radiation Hardening: No; REACH SVHC: No SVHC; Height: 40mm; Ratings: AEC-Q200; Max Operating Temperature: 105°C; RoHS Compliant: Yes; Construction: RADIAL; Lead Pitch: 7.5mm; Contact Plating: Tin; Voltage: 100V; Length: 40mm; Packaging: Bulk; Diameter: 16mm; Height - Seated (Max): 1.575inch; Voltage Rating (DC): 100V; Voltage Rating: 100V; ESR (Equivalent Series Resistance): 47mR; Case/Package: Radial; Lead Free: Lead Free; Tolerance: 20%; Series: FC; Capacitance: 470uF; Package Quantity: 100; Mount: Through Hole; Min Operating Temperature: -55°C; Termination: Radial
C3 = CAP-POLAR
C4 C?#4-C?#6 = CMP-1036-04552-2: CAP CER 0.22UF 50V X7R 0805; Manufacturer: KEMET; Manufacturer Part Number: C0805C224K5RACTU; Value: 0.22 μF; Temperature Coefficient: 30ppm/°C; Material: Ceramic; Tolerance: 0.1; ComponentLink2URL: https://content.kemet.com/datasheets/KEM_C1003_C0G_SMD.pdf; Temperature Characteristic: X7R; Device Class L3: Ceramic Capacitors; Lead Free: Yes; Temperature: -55°C to +125°C; RoHS: TRUE; Capacitance: 0.22 μF; Automotive: No; Octopart: https://octopart.com/c0805c224k5ractu-kemet-144670; Temperature Range Low: -55°C; Height: 0.88mm; Device Class L1: Passive Components; Digikey Description: CAP CER 0.22UF 50V X7R 0805; ComponentLink2Description: Datasheet; Mouser Description: CAP CER 0.22UF 50V X7R 0805; Category: Cap; Ipc Land Pattern Name: CAPC200125X78; Temperature Range High: +125°C; Package: C0805C-DN; Device Class L2: Capacitors; Voltage Rating: 50 V
C5 C20-C25 C27 C?#1-C?#3 = CMP-1036-04552-2: CAP CER 0.22UF 50V X7R 0805; Manufacturer: KEMET; Value: 0.22 μF; Temperature Coefficient: 30ppm/°C; Material: Ceramic; Tolerance: 0.1; ComponentLink2URL: https://content.kemet.com/datasheets/KEM_C1003_C0G_SMD.pdf; Temperature Characteristic: X7R; Device Class L3: Ceramic Capacitors; Lead Free: Yes; Temperature: -55°C to +125°C; RoHS: TRUE; Capacitance: 0.22 μF; Automotive: No; Octopart: https://octopart.com/c0805c224k5ractu-kemet-144670; Manufacturer Part Number: C0805C224K5RACTU; Temperature Range Low: -55°C; Height: 0.88mm; Device Class L1: Passive Components; Digikey Description: CAP CER 0.22UF 50V X7R 0805; ComponentLink2Description: Datasheet; Mouser Description: CAP CER 0.22UF 50V X7R 0805; Category: Cap; Ipc Land Pattern Name: CAPC200125X78; Temperature Range High: +125°C; Package: C0805C-DN; Device Class L2: Capacitors; Voltage Rating: 50 V
C6 C26 C28 = CMP-2007-03453-2: Chip Multilayer Ceramic Capacitors for General Purpose, 0805, 10uF, X5R, 15%, 10%, 16V; Radiation Hardening: No; Thickness: 0.053inch; Voltage Rating (DC): 16V; Lead Free: Lead Free; Package Quantity: 1; Width: 1.25mm; Case Code (Imperial): 0805; Depth: 1.25mm; Packaging: Tape and Reel; Dielectric: X5R; Max Operating Temperature: 85°C; Tolerance: 10%; Voltage Rating: 16V; Voltage: 16V; Capacitance: 10uF; Height: 1.25mm; Case Code (Metric): 2012; Material: Ceramic; Mount: Surface Mount; Case/Package: 0805; REACH SVHC: No SVHC; Length: 2mm; Min Operating Temperature: -55°C; Termination: SMD/SMT
C7 C29 C30 = CMP-2007-00279-2: CAP CER 0.1UF 50V X7R 0805; Manufacturer: KEMET; Value: 0.10 μF; Tolerance: 0.1; Temperature Coefficient: 30ppm/°C; Material: Ceramic; Manufacturer Part Number: C0805C104K5RACTU; Device Class L2: Capacitors; Temperature Range Low: -55°C; Voltage Rating: 50 V; Digikey Description: CAP CER 0.1UF 50V X7R 0805; Category: Cap; ComponentLink2Description: Datasheet; Octopart: https://octopart.com/c0805c104k5ractu-kemet-143926; RoHS: TRUE; ComponentLink2URL: https://content.kemet.com/datasheets/KEM_C1003_C0G_SMD.pdf; Temperature Characteristic: X7R; Temperature: -55°C to +125°C; Height: 0.88mm; Temperature Range High: +125°C; Device Class L1: Passive Components; Automotive: No; Lead Free: Yes; Ipc Land Pattern Name: CAPC200125X78; Device Class L3: Ceramic Capacitors; Mouser Description: Cap Ceramic 0.1uF 50V X7R 10% SMD 2.0 x 1.2 mm 125 C Paper T/R; Capacitance: 0.10 μF; Package: C0805C-DN
C9 C15 C16 C18 = CMP-12462-000027-1: CAP ALUM 100UF 20% 50V RADIAL; Life (Hours): 2000Hour; Ripple Current: 190mA; Leakage Current: 4uA; Termination: Radial; Mount: Through Hole; Length: 11.5mm; Series: KA; Case/Package: Radial; Package Quantity: 1; REACH SVHC: No SVHC; Height - Seated (Max): 0.512inch; Min Operating Temperature: -55°C; Packaging: Tape and Reel; Tolerance: 20%; Lead Pitch: 3.5mm; Voltage Rating (DC): 50V; Voltage Rating: 50V; Diameter: 8mm; Height: 11.5mm; Max Operating Temperature: 105°C; Capacitance: 100uF
C11 = 3.3uF_630V
C12 C17 = EEE1HA101AP: Capacitor Polarised; Manufacturer_Name: Panasonic; Datasheet Link: http://industrial.panasonic.com/cdbs/www-data/pdf/RDE0000/ABA0000C1142.pdf; Manufacturer_Part_Number: EEE1HA101AP
C19 = CMP-04424-000193-1: 47uF 16V  ±20% 500mΩ 2312  SMD Tantalum Capacitor; Polarity: Polar; ESR (Equivalent Series Resistance): 500mR; Dissipation Factor: 6%; Leakage Current: 7.5uA; RoHS Compliant: Yes; Case/Package: 6032-28; Construction: Flat; Case Code (Imperial): 2312; Package Quantity: 1; Voltage Rating: 16V; Length: 6mm; Height - Seated (Max): 0.11inch; Voltage Rating (DC): 16V; Series: TAJ; Features: General Purpose; Radiation Hardening: No; Case Code (Metric): 6032; Tolerance: 20%; Max Operating Temperature: 125°C; Depth: 3.2mm; REACH SVHC: No SVHC; Capacitance: 47uF; Width: 3.2mm; Height: 2.8mm; Lead Free: Lead Free; Packaging: Tape and Reel; Number of Pins: 2; Min Operating Temperature: -55°C; Mount: Surface Mount; Termination: SMD/SMT
CR1 CR2 = 1N5822RL: No Description Available; Mfr_Name: STMicroelectronics; Type: DEV; Copyright: Copyright (C) 2022 Ultra Librarian. All rights reserved.; Manufacturer_Part_Number: 1N5822RL; RefDes: RefDes
D1 D22 D27 = CMP-12791-000009-1: DIODE GEN PURP 400V 1A SMA; Manufacturer: Diodes Inc.; Max Surge Forward Current: 30A; Peak Reverse Current: 5uA; Standoff Height: 0.05mm; Value: 20pF; Max Junction Temp: +150°C; Digikey Description: DIODE GEN PURP 400V 1A SMA; ComponentLink2URL: https://www.diodes.com/assets/Datasheets/ds16008.pdf; Device Class L1: Discrete Semiconductors; Mouser Description: Rectifiers 400V 1A; Manufacturer Part Number: US1G-13-F; Package: SMA; Height: 2.4mm; Automotive: No; Temperature Range High: +150°C; RoHS: TRUE; Lead Free: Yes; Temperature: -65°C to +150°C; Category: Diode; Octopart: https://octopart.com/us1g-13-f-diodes+inc.-334651; Temperature Range Low: -65°C; Forward Current: 1A; Footprint Url: https://www.diodes.com/assets/Package-Files/SMA.pdf; ComponentLink2Description: Datasheet; Reverse Voltage: 400V; Capacitance: 20pF; Device Class L3: Rectifier Diodes; Max Repetitive Reverse Voltage: 400V; Device Class L2: Diodes
D2 D9 D23 D26 D28 D31 = CMP-02540-000074-1: DIODE GEN PURP 1KV 1A DO214BA; Forward Voltage: 1.2V; Reverse Recovery Time-Max: 2s; Recovery Time: 3000ns; Peak Non-Repetitive Surge Current: 30A; Max Reverse Current: 5uA; Reverse Recovery Time: 2us; Element Configuration: Single; Length: 4.75mm; Height: 2.74mm; Case/Package: DO-214BA; Average Rectified Current: 1A; Packaging: Tape and Reel; Forward Current: 1A; Width: 2.9mm; Package Quantity: 1; Max Repetitive Reverse Voltage (Vrrm): 1kV; Mount: Surface Mount; Radiation Hardening: No; Max Forward Surge Current (Ifsm): 30A; Max Surge Current: 30A; Reverse Voltage: 1kV; Max Operating Temperature: 175°C; RoHS Compliant: Yes; Series: SUPERECTIFIER®; Number of Pins: 2; Min Operating Temperature: -65°C; Lead Free: Lead Free; Max Reverse Voltage (DC): 1kV
D3 D4 D24 D25 D29 D30 = CMP-249167-000001-1: DIODE GEN PURP 75V 150MA SOD80; Manufacturer: Vishay Small Signal; Max Junction Temp: +175°C; Automotive Grade: Grade 0; Capacitance: 4pF; Peak Reverse Current: 5uA; Forward Current: 300mA; Max Repetitive Reverse Voltage: 100V; Max Surge Forward Current: 2A; Value: 4pF; ComponentLink2Description: Datasheet; Height: 1.6mm; ComponentLink2URL: http://www.vishay.com/docs/85557/ll4148.pdf; Category: Diode; Lead Free: Yes; Device Class L3: Rectifier Diodes; Reverse Voltage: 75V; Mouser Description: Diodes - General Purpose, Power, Switching 100 Volt 100mA; RoHS: TRUE; Temperature: to +175°C; Automotive: Yes; Octopart: https://octopart.com/ll4448-gs08-vishay+small+signal-40886; Digikey Description: DIODE GEN PURP 75V 150MA SOD80; Manufacturer Part Number: LL4448-GS08; Temperature Range High: +175°C; Device Class L1: Discrete Semiconductors; Device Class L2: Diodes; Package: 6.560-5005.01-4
D5-D8 = CMP-2000-04932-2: Fast Switching Diode, 100 V, 0.15 A, -65 to 150 degC, 2-Pin?SOD123, RoHS, Tape and Reel; Recovery Time: 4ns; Brand: DiodesIncorporated; Unit Weight: 0.000353oz; Max Surge Current: 2A; Peak Reverse Voltage: 100V; Ir - Reverse Current: 1uA; Vf - Forward Voltage: 1.25V; Configuration: Single; If - Forward Current: 0.15A; Product Category: Diodes-GeneralPurpose,Power,Switching; Operating Temperature Range: -65Cto+150C; Packaging: Reel; Manufacturer URL: http://www.diodes.com/; Maximum Operating Temperature: +150C; Height: 1.25mm; Minimum Operating Temperature: -65C; Product: SwitchingDiodes; Package URL: http://www.diodes.com/datasheets/ds18004.pdf; Type: SwitchingDiode; Package Reference: SOD123-2; Width: 1.7mm; Datasheet URL: http://www.farnell.com/datasheets/1915529.pdf; Datasheet Version: Rev. 24-2, 10/2013; Series: 1N4148; Factory Pack Quantity: 3000; Length: 2.85mm; RoHS: True; Manufacturer: DiodesIncorporated; Mounting Style: SMD/SMT; Package / Case: SOD-123
D10-D16 D19 D20 = CMP-02540-000021-1: DIODE GEN PURP 200V 3A DO214AB; Manufacturer: Vishay; Capacitance: 45pF; Value: 45pF; Max Surge Forward Current: 100A; Peak Reverse Current: 10uA; Standoff Height: 0mm; Max Junction Temp: +150°C; Height: 2.62mm; Category: Diode; Device Class L3: Rectifier Diodes; Manufacturer Part Number: ES3D-E3/57T; Temperature Range Low: -55°C; ComponentLink2URL: http://www.vishay.com/docs/88589/es3.pdf; Mouser Description: Rectifiers 3.0 Amp 200V 20ns; Package: 95402; Temperature Range High: +150°C; Octopart: https://octopart.com/es3d-e3%2F57t-vishay-39550290; Automotive: No; RoHS: TRUE; Forward Current: 3A; Temperature: -55°C to +150°C; Max Repetitive Reverse Voltage: 200V; Device Class L1: Discrete Semiconductors; Reverse Voltage: 200V; Lead Free: Yes; Digikey Description: DIODE GEN PURP 200V 3A DO214AB; Footprint Url: https://www.vishay.com/docs/95402/smc.pdf; ComponentLink2Description: Datasheet; Device Class L2: Diodes
D17 D18 D21 = 151031YS06000: WURTH ELEKTRONIK - 151031YS06000 - LED, Yellow, Through Hole, T-1 (3mm), 30 mA, 2 V, 590 nm; Geometry.Height: 5.5mm; Manufacturer_Name: Wurth Elektronik; Manufacturer_Part_Number: 151031YS06000; Mouser Part Number: 710-151031YS06000; Mouser Price/Stock: https://www.mouser.co.uk/ProductDetail/Wurth-Elektronik/151031YS06000?qs=LlUlMxKIyB3xSYYW%252BcuBiQ%3D%3D; Arrow Part Number: *; Arrow Price/Stock: *; Mouser Testing Part Number: *; Mouser Testing Price/Stock: *; Datasheet Link: https://katalog.we-online.de/led/datasheet/151031YS06000.pdf
J1-J3 = Connector_Tianli_T-800
L1 = DROSEL: Manufacturer: Wuerth Elektronik; Ui: 36V; ComponentLink1Description: Manufacturer URL; ComponentLink2Description: Datasheet; ComponentLink1URL: http://www.we-online.com; PartNumber: 750311457; PackageReference: EP13; ComponentLink2URL: http://katalog.we-online.de/pbs/datasheet/750311457.pdf
L3 L4 = 744776122: WE-PD2 SMT Power Inductor, size 1054, 22µH, 2.04A, 0.1Ω; Manufacturer: Wurth Elektronik; Case/Size Code: 1054; DC Resistance: 0.051Ω; Saturation Current: 2.07A; Self Resonant Frequency: 16MHz; Manufacturer Part Number: 744776122; Category: Unshielded Power Inductors; Match Code: WE-PD2; ComponentLink1Description: Website Link; ComponentLink1URL: https://www.we-online.com/redexpert/article/744776122?ad; ComponentLink2Description: Datasheet Link; ComponentLink2URL: https://www.we-online.com/redexpert/spec/744776122?ad; Mount: Surface Mount; Operating Temperature Max: 125°C; Operating Temperature Min: -40°C; Packaging: Tape and Reel; Length: 10mm; Width: 9mm; Height: 5.4mm; DC Resistance Max: 0.1Ω; Inductance: 22µH; Rated Current: 2.04A
Q1-Q4 = CMP-1168-00042-1: Low Loss IGBT in TrenchStop and Fieldstop Technology, PG-TO247-3-44, Tube, Green; Manufacturer: Infineon; IC(max) @ 25 degC: 100 A; Switching Frequency: TRENCHSTOP 2-20kHz; Green: TRUE; VCE(sat) (typ): 2.3 V; VCE (max): 1,200 V; DatasheetVersion: Rev. 2.4; ComponentLink2Description: Datasheet; PackageDescription: 3-Pin Plastic (Green) Transistor Single Outline Package, Body 15.915 x 20.95 mm, Pitch 5.44 mm; PartNumber: IGW60T120; PackageVersion: Rev. 05, 07/2010; ComponentLink1Description: Manufacturer URL; ComponentLink3URL: http://www.infineon.com/dgdl/IDW10S120_Rev+2.pdf?folderId=db3a304314dca38901151224afae0c96&fileId=db3a304336724dc40136789691a04aa5; RevisionNote: Lost Devices pt2; Mounting Technology: Through Hole; ComponentLink3Description: Package Specification; ComponentLink1URL: http://www.infineon.com/; ComponentLink2URL: http://www.infineon.com/dgdl/IGW60T120_Rev2_4G.pdf?folderId=db3a304412b407950112b408e8c90004&fileId=db3a304412b407950112b428250e3d74; Packing: Tube; PackageReference: PG-TO247-3-44_A; Halogen-free: FALSE
Q5 = CMP-65434-000005-1: OPTOISOLATOR 5KV TRANS 4SMD; Reverse Breakdown Voltage: 6V; Output Current per Channel: 30mA; Power Dissipation: 200mW; Collector-emitter Voltage-Max: 200mV; Max Output Voltage: 80V; Input Current: 50mA; Forward Voltage: 1.4V; Fall Time: 18000ns; Number of Elements: 1; Input Type: DC; Packaging: Tape and Reel; RoHS Compliant: Yes; Contact Plating: Copper; Min Operating Temperature: -30°C; Collector Emitter Saturation Voltage: 200mV; Max Input Current: 50mA; Radiation Hardening: No; Max Collector Current: 50mA; Case/Package: SMD/SMT; Mount: Surface Mount; Output Voltage: 80V; Forward Current: 50mA; Max Power Dissipation: 200mW; Collector Emitter Voltage (VCEO): 80V; Number of Channels: 1; Rise Time: 18000ns; Isolation Voltage: 5kV; Number of Pins: 4; Lead Free: Lead Free; Package Quantity: 2000; Isolation Voltage-Max: 5kV; Max Operating Temperature: 100°C
R1 = CMP-2001-04908-2: RES Thick Film, 470Ω, 1%, 0.125W, 100ppm/°C, 0805; Resistance: 10kR; Voltage Rating (DC): 150V; Power Rating: 125mW; Weight: 0.000194oz; Package Quantity: 5000; Military Standard: Not; Max Operating Temperature: 155°C; Temperature Coefficient: 100ppm/°C; Contact Plating: Tin; Width: 1.25mm; Height: 0.45mm; Radiation Hardening: No; Tolerance: 1%; Min Operating Temperature: -55°C; Voltage Rating: 150V; Length: 2mm; Depth: 1.25mm; Termination: SMD/SMT; Packaging: Tape and Reel; Case/Package: 0805; Case Code (Metric): 2012; Lead Free: Lead Free; Case Code (Imperial): 0805; Composition: Thick Film
R2 R3 R26 = CMP-03413-000003-1: RES 1.2 OHM 5W 5% AXIAL; Manufacturer: Yageo; Temperature Coefficient: 300ppm/°C; Resistance: 1.2Ω; Value: 1.2Ω; Voltage Rating: 350V; Lead Free: Yes; Package: SQP500; Composition: Wirewound; Series: SQP; Temperature: -55°C to +155°C; Device Class L2: Resistors; Digikey Description: RES 1.2 OHM 5W 5% AXIAL; RoHS: TRUE; Device Class L3: Through-Hole Resistors; ComponentLink2Description: Datasheet; ComponentLink2URL: https://datasheet.ciiva.com/2723/yageolr-sqpnsp-2013-2723111.pdf; Temperature Range High: +155°C; Manufacturer Part Number: SQP500JB-1R2; Octopart: https://octopart.com/sqp500jb-1r2-yageo-1162571; Device Class L1: Passive Components; Tolerance: 5%; Height: 10mm; Category: Res; Ipc Land Pattern Name: RESAD2911W100L2350D1050; Automotive: No; Power Rating: 5W; Temperature Range Low: -55°C
R4 R7 R9 R10 = CMP-2005-01987-2: RES SMD 3,3K OHM 1% 1/2W 1992; Resistance: 0mR; Temperature Coefficient: 0ppm/°C; Max Power Dissipation: 500mW; Voltage Rating: 200V; Packaging: Tape and Reel; Max Operating Temperature: 155°C; REACH SVHC: No SVHC; Min Operating Temperature: -55°C; Package Quantity: 1; Length: 3.2mm; Case Code (Metric): 3225; Case/Package: 1210; Composition: Thick Film; Military Standard: Not; Contact Plating: Tin; Case Code (Imperial): 1210; Radiation Hardening: No; Depth: 2.5mm; Termination: SMD/SMT; Features: Automotive AEC-Q200; Width: 0.098inch; Mount: Surface Mount; Power Rating: 500mW; Weight: 0.000564oz; Number of Terminations: 2; Height: 0.55mm
R5 = CMP-2005-01987-2: RES SMD 10K OHM 1% 1/2W 1992; Resistance: 0mR; Temperature Coefficient: 0ppm/°C; Max Power Dissipation: 500mW; Voltage Rating: 200V; Packaging: Tape and Reel; Max Operating Temperature: 155°C; REACH SVHC: No SVHC; Min Operating Temperature: -55°C; Package Quantity: 1; Length: 3.2mm; Case Code (Metric): 3225; Case/Package: 1210; Composition: Thick Film; Military Standard: Not; Contact Plating: Tin; Case Code (Imperial): 1210; Radiation Hardening: No; Depth: 2.5mm; Termination: SMD/SMT; Features: Automotive AEC-Q200; Width: 0.098inch; Mount: Surface Mount; Power Rating: 500mW; Weight: 0.000564oz; Number of Terminations: 2; Height: 0.55mm
R6 = CMP-2005-01987-2: RES SMD 205K OHM 1% 1/2W 1992; Resistance: 0mR; Temperature Coefficient: 0ppm/°C; Max Power Dissipation: 500mW; Voltage Rating: 200V; Packaging: Tape and Reel; Max Operating Temperature: 155°C; REACH SVHC: No SVHC; Min Operating Temperature: -55°C; Package Quantity: 1; Length: 3.2mm; Case Code (Metric): 3225; Case/Package: 1210; Composition: Thick Film; Military Standard: Not; Contact Plating: Tin; Case Code (Imperial): 1210; Radiation Hardening: No; Depth: 2.5mm; Termination: SMD/SMT; Features: Automotive AEC-Q200; Width: 0.098inch; Mount: Surface Mount; Power Rating: 500mW; Weight: 0.000564oz; Number of Terminations: 2; Height: 0.55mm
R11 R14 R15 R18-R20 R25 R27 R31-R33 R41 R42 R47 R48 R53-R56 = CRCW08050000Z0EA
  R11 R14 R15 R18-R20 R25 R27 R41 R42 R47 R48: 100k: *
R12 R13 R16 R49-R51 = CMP-2005-01987-2: RES SMD 300K OHM 1% 1/2W 1992; Resistance: 0mR; Temperature Coefficient: 0ppm/°C; Max Power Dissipation: 500mW; Voltage Rating: 200V; Packaging: Tape and Reel; Max Operating Temperature: 155°C; REACH SVHC: No SVHC; Min Operating Temperature: -55°C; Package Quantity: 1; Length: 3.2mm; Case Code (Metric): 3225; Case/Package: 1210; Composition: Thick Film; Military Standard: Not; Contact Plating: Tin; Case Code (Imperial): 1210; Radiation Hardening: No; Depth: 2.5mm; Termination: SMD/SMT; Features: Automotive AEC-Q200; Width: 0.098inch; Mount: Surface Mount; Power Rating: 500mW; Weight: 0.000564oz; Number of Terminations: 2; Height: 0.55mm
R17 R52 = CMP-2005-01987-2: RES SMD 1K OHM 1% 1/2W 1992; Resistance: 0mR; Temperature Coefficient: 0ppm/°C; Max Power Dissipation: 500mW; Voltage Rating: 200V; Packaging: Tape and Reel; Max Operating Temperature: 155°C; REACH SVHC: No SVHC; Min Operating Temperature: -55°C; Package Quantity: 1; Length: 3.2mm; Case Code (Metric): 3225; Case/Package: 1210; Composition: Thick Film; Military Standard: Not; Contact Plating: Tin; Case Code (Imperial): 1210; Radiation Hardening: No; Depth: 2.5mm; Termination: SMD/SMT; Features: Automotive AEC-Q200; Width: 0.098inch; Mount: Surface Mount; Power Rating: 500mW; Weight: 0.000564oz; Number of Terminations: 2; Height: 0.55mm
R21 R34 R43 = CMP-03412-028725-1: RES SMD 10 OHM 1% 1/8W 0805; Manufacturer: Yageo; Tolerance: 0.0001; Value: 10Ω; Temperature Coefficient: 50 ppm/°C; Voltage Rating: 150V; Power Rating: 0.125W; Package: RT0805; Lead Free: Yes; Manufacturer Part Number: RT0805FRE0710RL; Series: RT; Footprint Url: http://www.yageo.com/exep/pages/download/literatures/PYu-R_Mount_10.pdf; Temperature Range High: +155°C; Temperature Range Low: -55°C; Octopart: https://octopart.com/rt0805fre0710rl-yageo-39855890; Height: 0.6mm; Device Class L1: Passive Components; Mouser Description: High Precision-High Stability Chip Resistor Thin Film 0805 10Ohm 1% Paper T/R; ComponentLink2URL: http://www.yageo.com/documents/recent/PYu-RT_1-to-0.01_RoHS_L_9.pdf; Device Class L2: Resistors; Composition: Thin Film; Device Class L3: Chip SMD Resistors; Automotive: No; RoHS: TRUE; Ipc Land Pattern Name: RESC200125X50; Temperature: -55°C to +155°C; ComponentLink2Description: Datasheet; Resistance: 10Ω; Category: Res; Digikey Description: RES SMD 10 OHM 1% 1/8W 0805
R22 R35 R44 = CMP-03412-028725-1: RES SMD 10 OHM 1% 1/8W 0805; Manufacturer Part Number: RT0805FRE0710RL; Manufacturer: Yageo; Tolerance: 0.0001; Value: 10Ω; Temperature Coefficient: 50 ppm/°C; Voltage Rating: 150V; Power Rating: 0.125W; Package: RT0805; Lead Free: Yes; Series: RT; Footprint Url: http://www.yageo.com/exep/pages/download/literatures/PYu-R_Mount_10.pdf; Temperature Range High: +155°C; Temperature Range Low: -55°C; Octopart: https://octopart.com/rt0805fre0710rl-yageo-39855890; Height: 0.6mm; Device Class L1: Passive Components; Mouser Description: High Precision-High Stability Chip Resistor Thin Film 0805 10Ohm 1% Paper T/R; ComponentLink2URL: http://www.yageo.com/documents/recent/PYu-RT_1-to-0.01_RoHS_L_9.pdf; Device Class L2: Resistors; Composition: Thin Film; Device Class L3: Chip SMD Resistors; Automotive: No; RoHS: TRUE; Ipc Land Pattern Name: RESC200125X50; Temperature: -55°C to +155°C; ComponentLink2Description: Datasheet; Resistance: 10Ω; Category: Res; Digikey Description: RES SMD 10 OHM 1% 1/8W 0805
R23 R24 R36 R39 R45 R46 = CMP-2001-04908-2: RES Thick Film, 10kΩ, 1%, 0.125W, 100ppm/°C, 0805; Resistance: 10kR; Voltage Rating (DC): 150V; Power Rating: 125mW; Weight: 0.000194oz; Package Quantity: 5000; Military Standard: Not; Max Operating Temperature: 155°C; Temperature Coefficient: 100ppm/°C; Contact Plating: Tin; Width: 1.25mm; Height: 0.45mm; Radiation Hardening: No; Tolerance: 1%; Min Operating Temperature: -55°C; Voltage Rating: 150V; Length: 2mm; Depth: 1.25mm; Termination: SMD/SMT; Packaging: Tape and Reel; Case/Package: 0805; Case Code (Metric): 2012; Lead Free: Lead Free; Case Code (Imperial): 0805; Composition: Thick Film
R28-R30 R37 R38 = CMP-2001-04908-2: RES Thick Film, 10KΩ, 1%, 0.125W, 100ppm/°C, 0805; Resistance: 10kR; Voltage Rating (DC): 150V; Power Rating: 125mW; Weight: 0.000194oz; Package Quantity: 5000; Military Standard: Not; Max Operating Temperature: 155°C; Temperature Coefficient: 100ppm/°C; Contact Plating: Tin; Width: 1.25mm; Height: 0.45mm; Radiation Hardening: No; Tolerance: 1%; Min Operating Temperature: -55°C; Voltage Rating: 150V; Length: 2mm; Depth: 1.25mm; Termination: SMD/SMT; Packaging: Tape and Reel; Case/Package: 0805; Case Code (Metric): 2012; Lead Free: Lead Free; Case Code (Imperial): 0805; Composition: Thick Film
R?#1-R?#6 = RC0805FR-07100KL
RP1 RP2 = 3296W-1-202LF
T2 = Transformer: Manufacturer: Wuerth Elektronik; Ui: 36V; ComponentLink1Description: Manufacturer URL; ComponentLink2Description: Datasheet; ComponentLink1URL: http://www.we-online.com; PartNumber: 750311457; PackageReference: EP13; ComponentLink2URL: http://katalog.we-online.de/pbs/datasheet/750311457.pdf
TP1-TP46 TP?#1-TP?#6 = TP_PCB?: Test_Point
U1 U8 U9 = CMP-32851-000156-1: MOSFET DRVR 600V 0.36A 2-OUT Hi/Lo Side Non-Inv 8-Pin SOIC
U2 U3 = LM7812
U4 U5 = LM2576D2T-005G
U6 = CMP-0062-01639-4: 800mA Low-Dropout Linear Regulator, 4-pin SOT-223, Pb-Free; Manufacturer: Texas Instruments; High-Reliability: Y; PowerWise: N; PackageTopMarking: XYTT*N05A; CompType: LDO IC; ComponentLink1URL: http://www.ti.com/general/docs/lit/getliterature.tsp?genericPartNumber=LM1117-N&fileType=pdf; PartNumber: LM1117MPX-3.3/NOPB; ComponentLink1Description: Datasheet URL; PinCount: 4; Code_JEDEC: TO-261-AA; PackageDescription: Molded SOT-223, 6.50 x 3.56 x 1.6mm Body, 4 Lead, 2.3mm Pitch; PackageReference: DCY0004A; RoHS: Y; Code_IPC: SOT223-4
U7 = CMP-0243-00091-2: ARM Cortex-M4 32-bit MCU+FPU, 105 DMIPS, 256 kB Flash, 64 kB Internal RAM, 48 I/Os, 64-pin LQFP, -40 to 85 degC, Tray; Manufacturer: STMicroelectronics; Internal RAM Size (kB): 64; Supply Voltage(Vcc) max (V): 3.6; FLASH Size (Prog) (kB): 256; I/Os (High Current): 48; Operating Frequency(F) (Processor speed) (MHz): 84; Supply Voltage(Vcc) min (V): 1.8; DatasheetVersion: Rev. 1; ComponentLink1URL: http://www.st.com/web/en/home.html; ComponentLink1Description: Manufacturer URL; PackageDescription: 64-Pin Low Profile Quad Flat Package, 10 x 10 mm Body, 0.5 mm Pitch; Packing: Tray; ComponentLink3URL: http://www.st.com/st-web-ui/static/active/en/resource/technical/document/datasheet/DM00037051.pdf; PackageVersion: Rev. 4, 06/2013; ComponentLink2URL: http://www.st.com/st-web-ui/static/active/en/resource/technical/document/data_brief/DM00071938.pdf; PartNumber: STM32F401RCT6; PackageReference: LQFP64; Mounting Technology: Surface Mount; ComponentLink2Description: Datasheet; ComponentLink3Description: Package Specification; Core: ARM Cortex-M4
U10 = CMP-0003-00378-2: 16-Bit ADC with Integrated Multiplexer, PGA, Comparator, Oscillator, and Reference, -40 to 125 degC, 10-pin SOP (DGS10), Green (RoHS & no Sb/Br); Manufacturer: Texas Instruments; Sample Rate (max)(SPS): 860; SubFamily: Precision ADC (<=10MSPS); Architecture: Delta-Sigma; Digital Supply(Min)(V): 2; Resolution(Bits): 16; Digital Supply(Max)(V): 5.5; INL(Max)(+/-LSB): 1; Interface: Serial I2C; # Input Channels: 4; Eco-Plan: Green (RoHS & no Sb/Br); PackageDescription: 10-Pin Plastic Small Outline, Body 3 x 3 mm, Pitch 0.5 mm; Mounting Technology: Surface Mount; PackageReference: DGS10; DatasheetVersion: SBAS444B; ComponentLink3Description: Package Specification; ComponentLink1Description: Manufacturer URL; PartNumber: ADS1115IDGST; ComponentLink3URL: http://www.ti.com/lit/ml/mpds035b/mpds035b.pdf; ComponentLink2URL: http://www.ti.com/general/docs/lit/getliterature.tsp?genericPartNumber=ADS1115&fileType=pdf; Analog Voltage AV/DD(Min)(V): 2; ComponentLink2Description: Datasheet; PackageVersion: 4073272/C, 02/2004; Analog Voltage AV/DD(Max)(V): 5.5; Code_JEDEC: MO-153; ComponentLink1URL: http://www.ti.com/
VT2-VT7 = IRF3205: Транзистор МОП, одиночный, N-канальный; ComponentDescription: =ComponentType+', '+ChannelType+', '+Comment+', '+Package; ChannelType: N-канальный; ComponentType: Транзистор МОП, одиночный; Package: TO-220(bend2)